# EAGLE design L3DCube_6x6x6_BaseBoard_Rev1.2 (EAGLE 7.6.0)
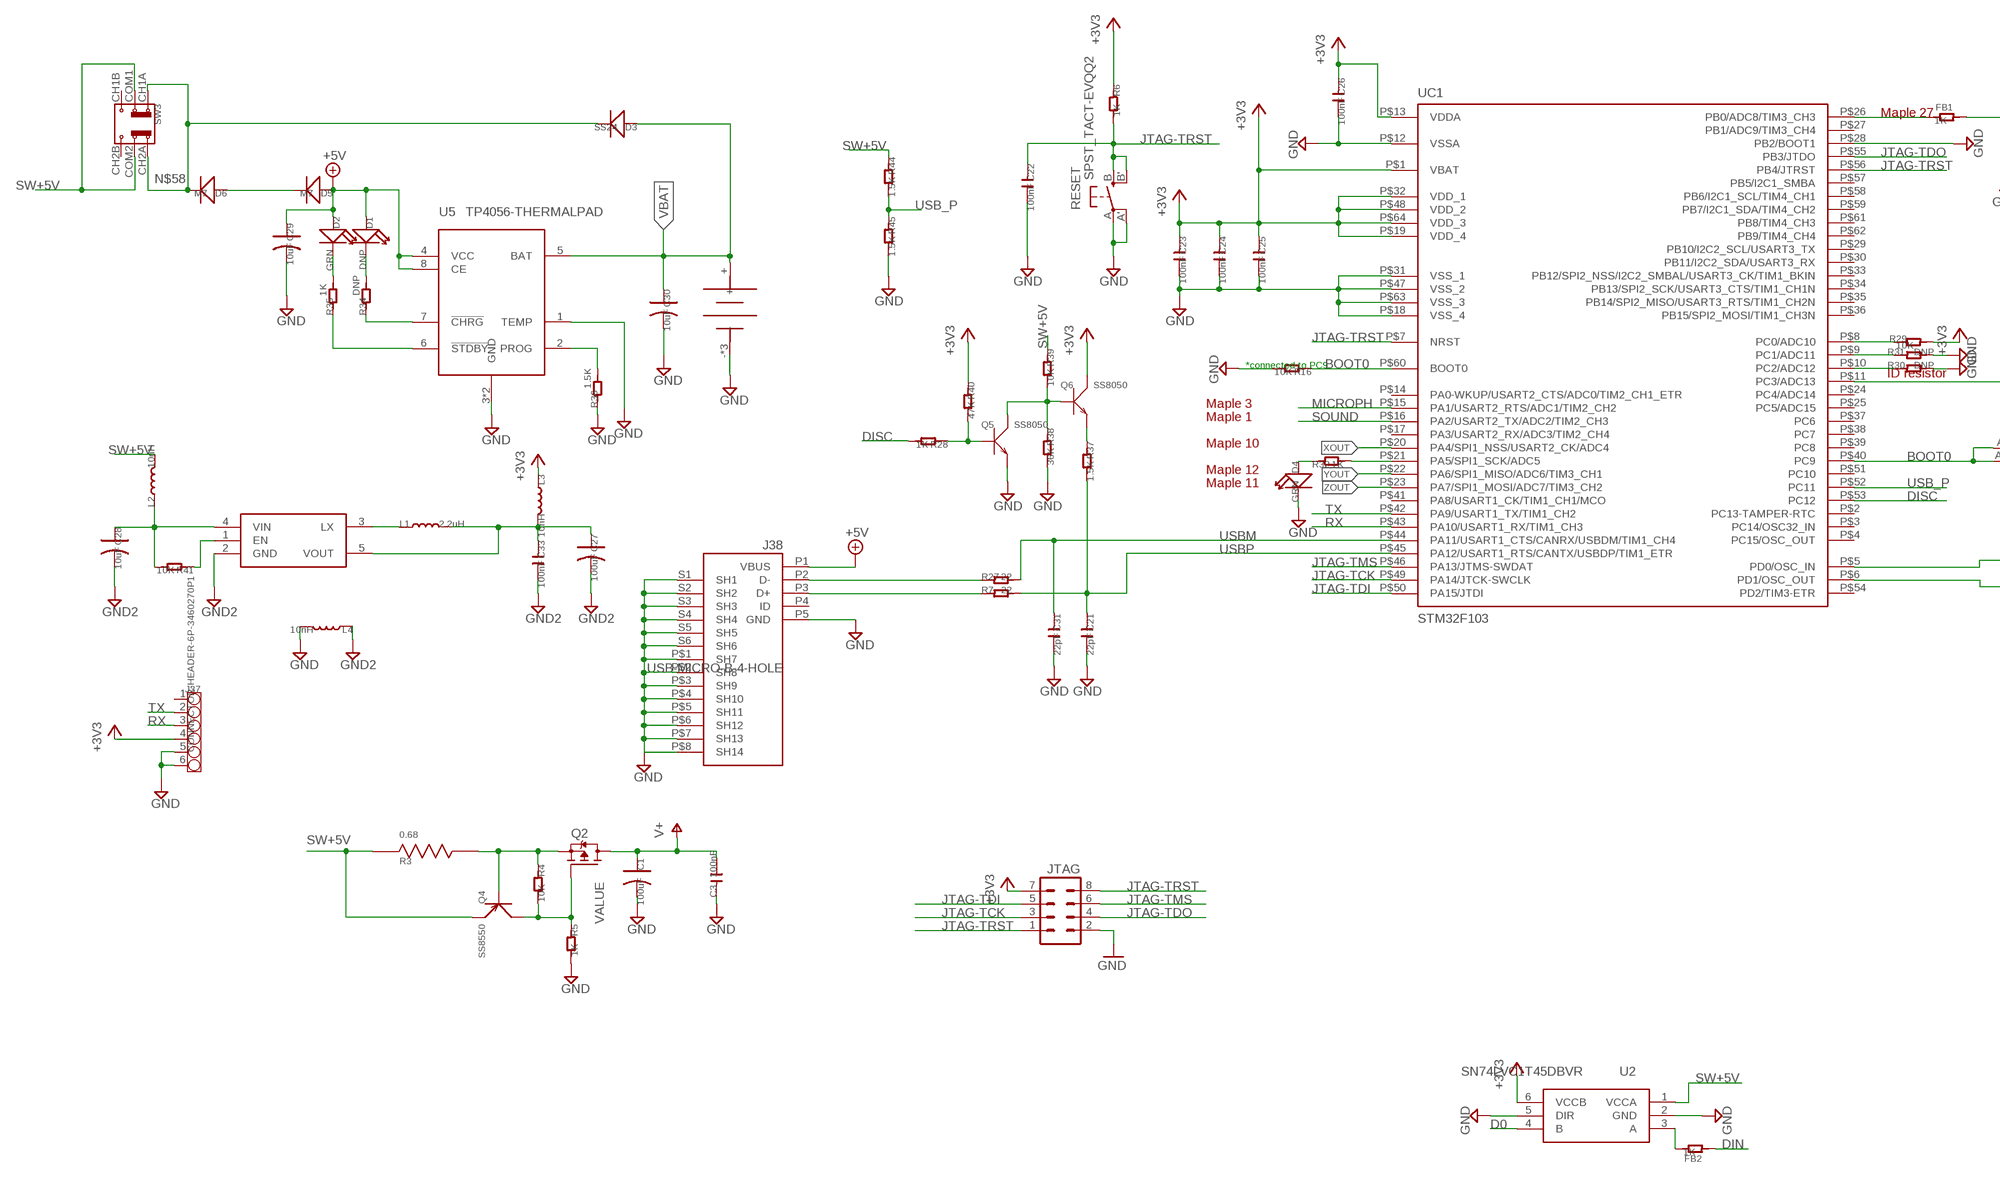
[diagram p0: schematic, sheet 1, part 1 of 2]
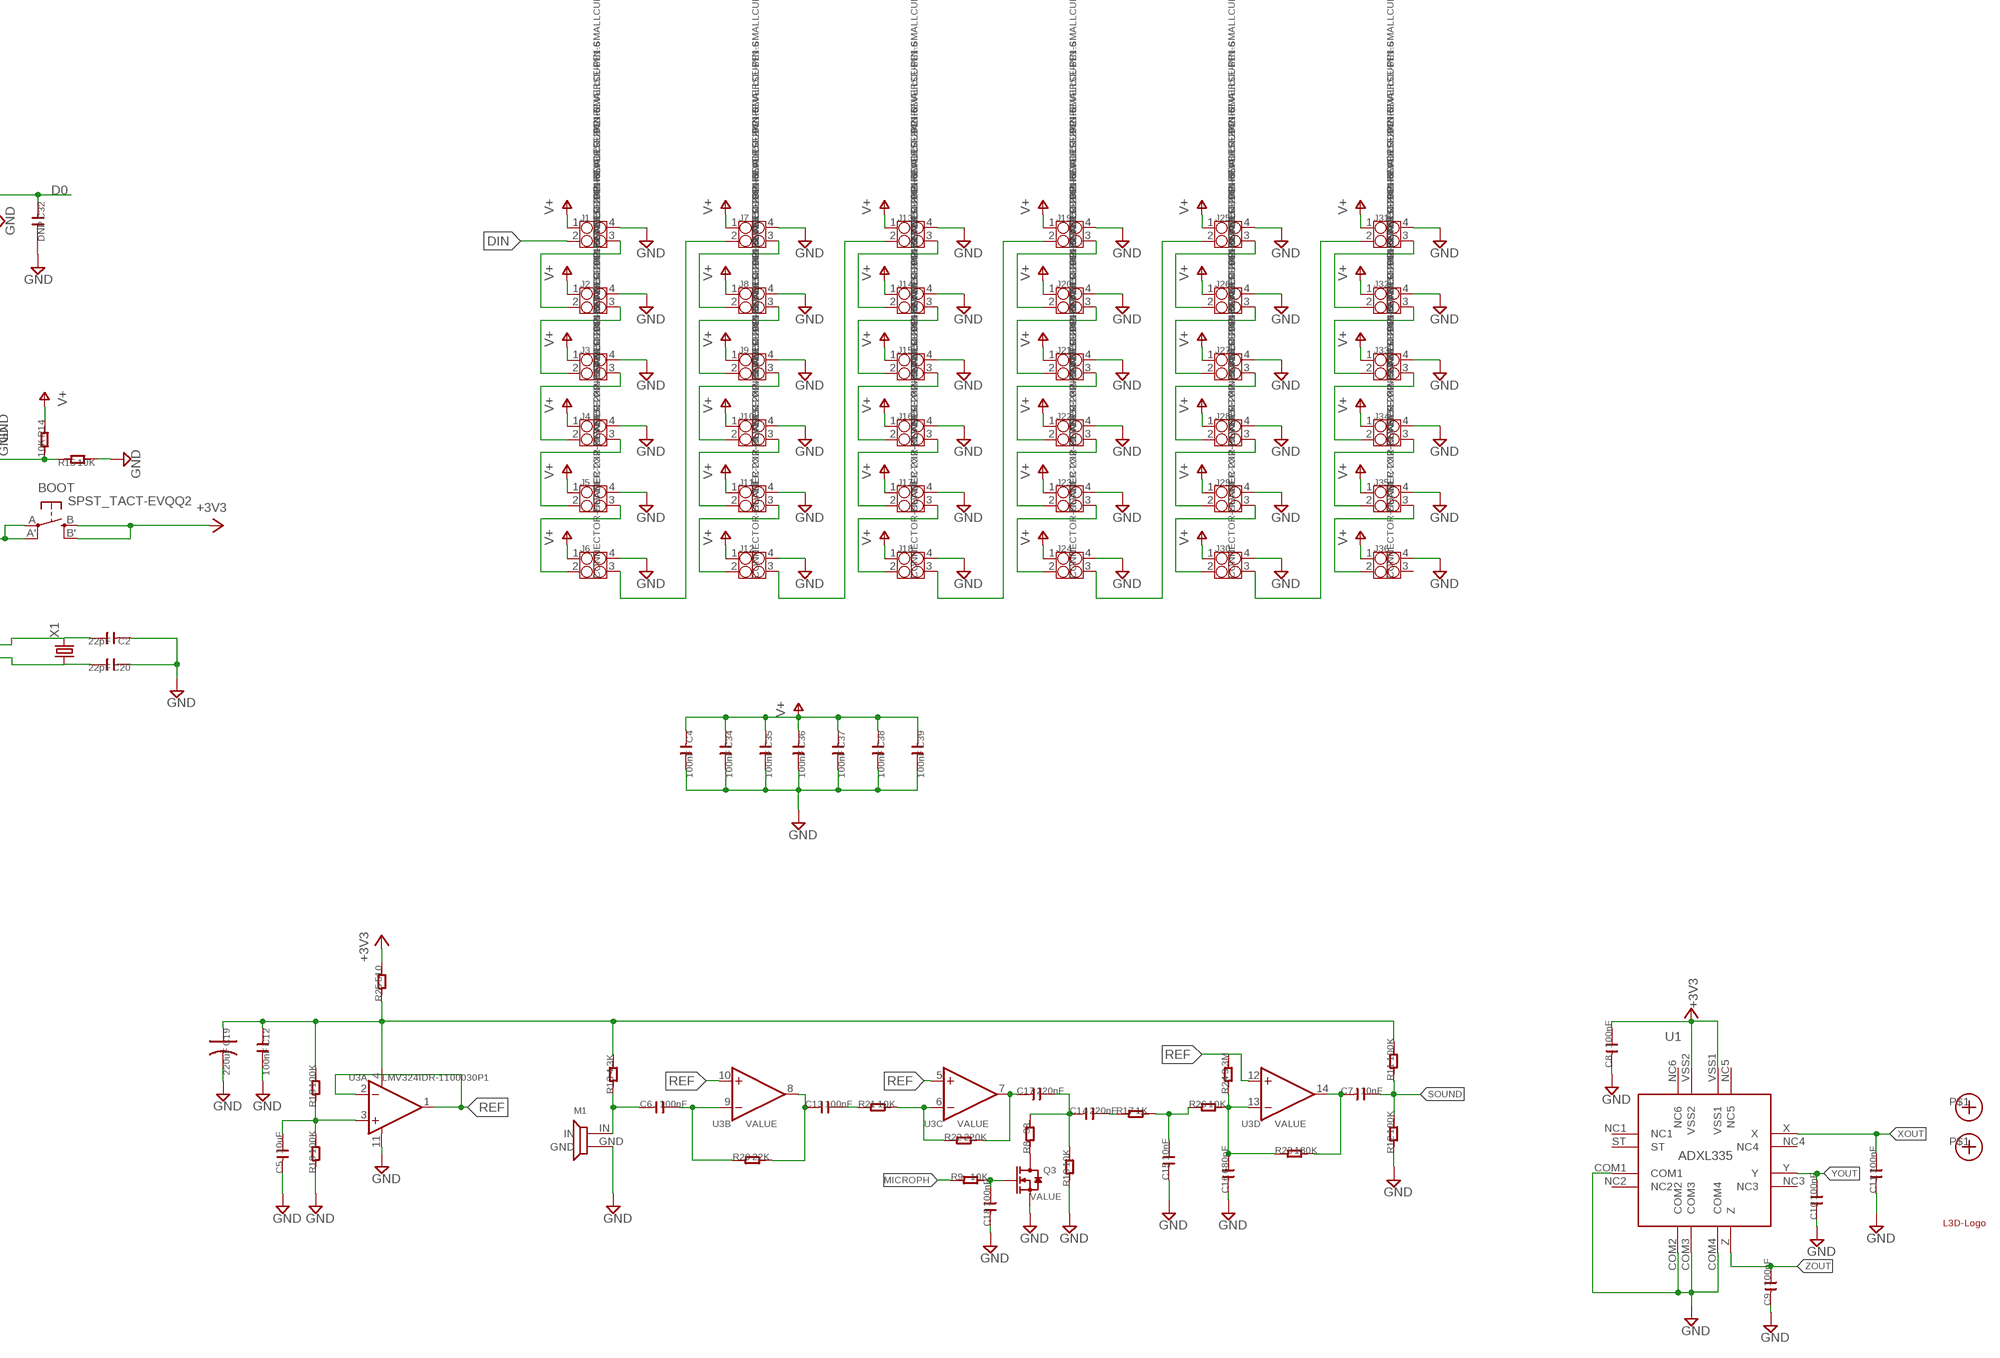
[diagram p1: schematic, sheet 1, part 2 of 2]

## Parts
B1  BATTERY  [2P-SMD-2.0-90D]
BOOT  SPST_TACT-EVQQ2  [EVQ-Q2]
C1  100uF  C-POLAR-B  [AVX-B]
C2  22pF  C-0603  [C0603]
C3  100nF  C-0603  [C0603]
C4  100nF  C-0603  [C0603]
C5  10uF  C-0603  [C0603]
C6  100nF  C-0603  [C0603]
C7  10nF  C-0603  [C0603]
C8  100nF  C-0603  [C0603]
C9  100nF  C-0603  [C0603]
C10  100nF  C-0603  [C0603]
C11  100nF  C-0603  [C0603]
C12  100nF  C-0603  [C0603]
C13  100nF  C-0603  [C0603]
C14  220nF  C-0603  [C0603]
C15  10nF  C-0603  [C0603]
C16  680pF  C-0603  [C0603]
C17  220nF  C-0603  [C0603]
C18  100nF  C-0603  [C0603]
C19  220uF  C-POLAR-B  [AVX-B]
C20  22pF  C-0603  [C0603]
C21  22pF  C-0603  [C0603]
C22  100nF  C-0603  [C0603]
C23  100nF  C-0603  [C0603]
C24  100nF  C-0603  [C0603]
C25  100nF  C-0603  [C0603]
C26  100nF  C-0603  [C0603]
C27  100uF  C-POLAR-B  [AVX-B]
C28  10uF  C-POLAR-A  [AVX-A]
C29  10uF  C-POLAR-A  [AVX-A]
C30  10uF  C-POLAR-A  [AVX-A]
C31  22pF  C-0603  [C0603]
C32  DNP  C-0603  [C0603]
C33  100nF  C-0603  [C0603]
C34  100nF  C-0603  [C0603]
C35  100nF  C-0603  [C0603]
C36  100nF  C-0603  [C0603]
C37  100nF  C-0603  [C0603]
C38  100nF  C-0603  [C0603]
C39  100nF  C-0603  [C0603]
D1  DNP  LED  [LED0603]
D2  GRN  LED  [LED0603]
D3  SS24  D-SMB  [SMB]
D4  GRN  LED  [LED0603]
D5  M7  D-SMA  [DO-214AC]
D6  M7  D-SMA  [DO-214AC]
FB1  1K  R-0603  [R0603]
FB2  1K  R-0603  [R0603]
J1  CONNECTOR-HEADER-2X2-REVERSE-PIN-SMALLCUBE1.6  [2X2P-2.54-6X6X6-CUBE-TH]
J2  CONNECTOR-HEADER-2X2-REVERSE-PIN-SMALLCUBE1.6  [2X2P-2.54-6X6X6-CUBE-TH]
J3  CONNECTOR-HEADER-2X2-REVERSE-PIN-SMALLCUBE1.6  [2X2P-2.54-6X6X6-CUBE-TH]
J4  CONNECTOR-HEADER-2X2-REVERSE-PIN-SMALLCUBE1.6  [2X2P-2.54-6X6X6-CUBE-TH]
J5  CONNECTOR-HEADER-2X2-REVERSE-PIN-SMALLCUBE1.6  [2X2P-2.54-6X6X6-CUBE-TH]
J6  CONNECTOR-HEADER-2X2-REVERSE-PIN-SMALLCUBE1.6  [2X2P-2.54-6X6X6-CUBE-TH]
J7  CONNECTOR-HEADER-2X2-REVERSE-PIN-SMALLCUBE1.6  [2X2P-2.54-6X6X6-CUBE-TH]
J8  CONNECTOR-HEADER-2X2-REVERSE-PIN-SMALLCUBE1.6  [2X2P-2.54-6X6X6-CUBE-TH]
J9  CONNECTOR-HEADER-2X2-REVERSE-PIN-SMALLCUBE1.6  [2X2P-2.54-6X6X6-CUBE-TH]
J10  CONNECTOR-HEADER-2X2-REVERSE-PIN-SMALLCUBE1.6  [2X2P-2.54-6X6X6-CUBE-TH]
J11  CONNECTOR-HEADER-2X2-REVERSE-PIN-SMALLCUBE1.6  [2X2P-2.54-6X6X6-CUBE-TH]
J12  CONNECTOR-HEADER-2X2-REVERSE-PIN-SMALLCUBE1.6  [2X2P-2.54-6X6X6-CUBE-TH]
J13  CONNECTOR-HEADER-2X2-REVERSE-PIN-SMALLCUBE1.6  [2X2P-2.54-6X6X6-CUBE-TH]
J14  CONNECTOR-HEADER-2X2-REVERSE-PIN-SMALLCUBE1.6  [2X2P-2.54-6X6X6-CUBE-TH]
J15  CONNECTOR-HEADER-2X2-REVERSE-PIN-SMALLCUBE1.6  [2X2P-2.54-6X6X6-CUBE-TH]
J16  CONNECTOR-HEADER-2X2-REVERSE-PIN-SMALLCUBE1.6  [2X2P-2.54-6X6X6-CUBE-TH]
J17  CONNECTOR-HEADER-2X2-REVERSE-PIN-SMALLCUBE1.6  [2X2P-2.54-6X6X6-CUBE-TH]
J18  CONNECTOR-HEADER-2X2-REVERSE-PIN-SMALLCUBE1.6  [2X2P-2.54-6X6X6-CUBE-TH]
J19  CONNECTOR-HEADER-2X2-REVERSE-PIN-SMALLCUBE1.6  [2X2P-2.54-6X6X6-CUBE-TH]
J20  CONNECTOR-HEADER-2X2-REVERSE-PIN-SMALLCUBE1.6  [2X2P-2.54-6X6X6-CUBE-TH]
J21  CONNECTOR-HEADER-2X2-REVERSE-PIN-SMALLCUBE1.6  [2X2P-2.54-6X6X6-CUBE-TH]
J22  CONNECTOR-HEADER-2X2-REVERSE-PIN-SMALLCUBE1.6  [2X2P-2.54-6X6X6-CUBE-TH]
J23  CONNECTOR-HEADER-2X2-REVERSE-PIN-SMALLCUBE1.6  [2X2P-2.54-6X6X6-CUBE-TH]
J24  CONNECTOR-HEADER-2X2-REVERSE-PIN-SMALLCUBE1.6  [2X2P-2.54-6X6X6-CUBE-TH]
J25  CONNECTOR-HEADER-2X2-REVERSE-PIN-SMALLCUBE1.6  [2X2P-2.54-6X6X6-CUBE-TH]
J26  CONNECTOR-HEADER-2X2-REVERSE-PIN-SMALLCUBE1.6  [2X2P-2.54-6X6X6-CUBE-TH]
J27  CONNECTOR-HEADER-2X2-REVERSE-PIN-SMALLCUBE1.6  [2X2P-2.54-6X6X6-CUBE-TH]
J28  CONNECTOR-HEADER-2X2-REVERSE-PIN-SMALLCUBE1.6  [2X2P-2.54-6X6X6-CUBE-TH]
J29  CONNECTOR-HEADER-2X2-REVERSE-PIN-SMALLCUBE1.6  [2X2P-2.54-6X6X6-CUBE-TH]
J30  CONNECTOR-HEADER-2X2-REVERSE-PIN-SMALLCUBE1.6  [2X2P-2.54-6X6X6-CUBE-TH]
J31  CONNECTOR-HEADER-2X2-REVERSE-PIN-SMALLCUBE1.6  [2X2P-2.54-6X6X6-CUBE-TH]
J32  CONNECTOR-HEADER-2X2-REVERSE-PIN-SMALLCUBE1.6  [2X2P-2.54-6X6X6-CUBE-TH]
J33  CONNECTOR-HEADER-2X2-REVERSE-PIN-SMALLCUBE1.6  [2X2P-2.54-6X6X6-CUBE-TH]
J34  CONNECTOR-HEADER-2X2-REVERSE-PIN-SMALLCUBE1.6  [2X2P-2.54-6X6X6-CUBE-TH]
J35  CONNECTOR-HEADER-2X2-REVERSE-PIN-SMALLCUBE1.6  [2X2P-2.54-6X6X6-CUBE-TH]
J36  CONNECTOR-HEADER-2X2-REVERSE-PIN-SMALLCUBE1.6  [2X2P-2.54-6X6X6-CUBE-TH]
J37  CONNECTOR-HEADER-6P-3460270P1  [1X6P-2.54-8.5-BLACK-FEMALE]
J38  USB-MICRO-B-4-HOLE  [CON2_USB_MICRO_B_AT]
JTAG  MA04-2  [MA04-2]
L1  2.2uH  L-SPD3D16-4R7M  [L0420]
L2  10nH  L-0603  [L0603]
L3  10nH  L-0603  [L0603]
L4  10nH  L-0603  [L0603]
M1  MICROPHONE  [MICROPHONE]
Q2  FDD6637  FDD4141TO252  [TO252]
Q3  2N7002  MOSFET-N-044020001  [SOT23]
Q4  SS8550  TRANSISTOR-PNP-041003001  [SOT23]
Q5  SS8050  TRANSISTOR-NPN-0400000P1  [SOT23]
Q6  SS8050  TRANSISTOR-NPN-0400000P1  [SOT23]
R3  0.68  RESISTOR-3W-20MM  [RESISTOR-3W-20MM]
R4  10K  R-0603  [R0603]
R5  1K  R-0603  [R0603]
R6  1K  R-0603  [R0603]
R7  22  R-0603  [R0603]
R8  33  R-0603  [R0603]
R9  10K  R-0603  [R0603]
R10  10K  R-0603  [R0603]
R11  100K  R-0603  [R0603]
R12  100K  R-0603  [R0603]
R13  4.3K  R-0603  [R0603]
R14  10K  R-0603  [R0603]
R15  10K  R-0603  [R0603]
R16  10K  R-0603  [R0603]
R17  1K  R-0603  [R0603]
R18  100K  R-0603  [R0603]
R19  100K  R-0603  [R0603]
R20  22K  R-0603  [R0603]
R21  10K  R-0603  [R0603]
R22  220K  R-0603  [R0603]
R23  180K  R-0603  [R0603]
R24  3.3M  R-0603  [R0603]
R25  510  R-0603  [R0603]
R26  10K  R-0603  [R0603]
R27  22  R-0603  [R0603]
R28  1K  R-0603  [R0603]
R29  10K  R-0603  [R0603]
R30  DNP  R-0603  [R0603]
R31  DNP  R-0603  [R0603]
R32  1K  R-0603  [R0603]
R34  DNP  R-0603  [R0603]
R35  1K  R-0603  [R0603]
R36  1.5K  R-0603  [R0603]
R37  1.5K  R-0603  [R0603]
R38  36K  R-0603  [R0603]
R39  10K  R-0603  [R0603]
R40  47K  R-0603  [R0603]
R41  10K  R-0402  [R0402]
R44  1.5K  R-0603  [R0603]
R45  1.5K  R-0603  [R0603]
RESET  SPST_TACT-EVQQ2  [EVQ-Q2]
SW3  SWITCH-22D02  [SWITCH-22D02]
U1  ADXL335  [ADXL335]
U2  SN74LVC1T45DBVR  [SOT23-6]
U3  LMV324IDR-1100030P1  [SOIC14]
U5  TP4056-THERMALPAD  [SOIC8-PAD]
U11  R8008-33  [SOT23-5]
U$1  L3D-LOGOL3DCUBE-LOGO-0.8X2.5  [L3DCUBE-LOGO-0.8X2.5]
U$2  FIDUCIAL-MARK  [FIDUCIAL-MARK]
U$3  FIDUCIAL-MARK  [FIDUCIAL-MARK]
UC1  STM32F103  [TQFP-10X10-64]
X1  CRYSTALSM49  [SM49]

## Nets
+3V3: BOOT.B'(S1) BOOT.B(S) C8.2 C23.1 C24.1 C25.1 C26.1 J37.4 JTAG.7 L3.1 Q6.3(C) R6.1 R25.2 R29.1 R40.1 U1.VSS1 U1.VSS2 U2.6(VCCB) UC1.P$1(VBAT) UC1.P$13(VDDA) UC1.P$19(VDD_4) UC1.P$32(VDD_1) UC1.P$48(VDD_2) UC1.P$64(VDD_3)
+5V: C29.+ D1.+ D2.+ D5.1(+) J38.P1(VBUS) U5.4(VCC) U5.8(CE)
BOOT0: BOOT.A'(P1) BOOT.A(P) R16.1 UC1.P$40(PC9) UC1.P$60(BOOT0)
D0: C32.1 FB1.1 U2.4(B)
DIN: FB2.1 J1.2
DISC: R28.2 UC1.P$53(PC12)
ENABLE [vcc]: R41.1 U11.1(EN)
GND [vcc]: B1.3(-) B1.4(-) B1.- C1.- C2.1 C3.1 C4.2 C5.1 C8.1 C9.1 C10.1 C11.1 C12.2 C15.1 C16.1 C18.1 C19.- C20.1 C21.2 C22.2 C23.2 C24.2 C25.2 C26.2 C29.- C30.- C31.2 C32.2 C34.2 C35.2 C36.2 C37.2 C38.2 C39.2 D4.- J1.4 J2.4 J3.4 J4.4 J5.4 J6.4 J7.4 J8.4 J9.4 J10.4 J11.4 J12.4 J13.4 J14.4 J15.4 J16.4 J17.4 J18.4 J19.4 J20.4 J21.4 J22.4 J23.4 J24.4 J25.4 J26.4 J27.4 J28.4 J29.4 J30.4 J31.4 J32.4 J33.4 J34.4 J35.4 J36.4 J37.5 J37.6 J38.P5(GND) J38.P$1(SH7) J38.P$2(SH8) J38.P$3(SH9) J38.P$4(SH10) J38.P$5(SH11) J38.P$6(SH12) J38.P$7(SH13) J38.P$8(SH14) J38.S1(SH1) J38.S2(SH2) J38.S3(SH3) J38.S4(SH4) J38.S5(SH5) J38.S6(SH6) JTAG.2 L4.2 M1.GND Q3.2(S) Q5.2(E) R5.2 R10.1 R12.1 R15.2 R16.2 R19.1 R30.2 R31.2 R36.1 R38.2 R45.2 RESET.A'(P1) RESET.A(P) U1.COM1 U1.COM2 U1.COM3 U1.COM4 U2.2(GND) U2.5(DIR) U3.11(A:V-) U5.1(TEMP) U5.3(GND) U5.GND1(GND) UC1.P$12(VSSA) UC1.P$18(VSS_4) UC1.P$28(PB2/BOOT1) UC1.P$31(VSS_1) UC1.P$47(VSS_2) UC1.P$63(VSS_3)
GND2: C27.- C28.- C33.2 L4.1 U11.2(GND)
JTAG-TCK: JTAG.3 UC1.P$49(PA14/JTCK-SWCLK)
JTAG-TDI: JTAG.5 UC1.P$50(PA15/JTDI)
JTAG-TDO: JTAG.4 UC1.P$55(PB3/JTDO)
JTAG-TMS: JTAG.6 UC1.P$46(PA13/JTMS-SWDAT)
JTAG-TRST: C22.1 JTAG.1 JTAG.8 R6.2 RESET.B'(S1) RESET.B(S) UC1.P$7(NRST) UC1.P$56(PB4/JTRST)
LED1: D4.+ R32.1
MICROPH: R9.1 UC1.P$15(PA1/USART2_RTS/ADC1/TIM2_CH2)
N$1: J1.3 J2.2
N$2: J2.3 J3.2
N$3: J3.3 J4.2
N$4: J4.3 J5.2
N$5: J5.3 J6.2
N$6: J7.3 J8.2
N$7: J8.3 J9.2
N$8: J9.3 J10.2
N$9: J10.3 J11.2
N$10: J11.3 J12.2
N$11: J13.3 J14.2
N$12: J14.3 J15.2
N$13: J15.3 J16.2
N$14: J16.3 J17.2
N$15: J17.3 J18.2
N$16: J19.3 J20.2
N$17: J20.3 J21.2
N$18: J21.3 J22.2
N$19: J22.3 J23.2
N$20: J23.3 J24.2
N$21: J25.3 J26.2
N$22: J26.3 J27.2
N$23: J27.3 J28.2
N$24: J28.3 J29.2
N$25: J29.3 J30.2
N$26: J31.3 J32.2
N$27: J32.3 J33.2
N$28: J33.3 J34.2
N$29: J34.3 J35.2
N$30: J35.3 J36.2
N$31: J6.3 J7.2
N$32: C18.2 Q3.1(G) R9.2
N$33: J12.3 J13.2
N$34: J18.3 J19.2
N$35: J24.3 J25.2
N$36: J30.3 J31.2
N$37: C2.2 UC1.P$5(PD0/OSC_IN) X1.2
N$38: C20.2 UC1.P$6(PD1/OSC_OUT) X1.1
N$39: R14.2 R15.1 UC1.P$11(PC3/ADC13)
N$40: J38.P2(D-) R27.1
N$41: L1.1 U11.3(LX)
N$42: D1.- R34.2
N$43: R32.2 UC1.P$21(PA5/SPI1_SCK/ADC5)
N$44: FB1.2 UC1.P$26(PB0/ADC8/TIM3_CH3)
N$45: R29.2 UC1.P$8(PC0/ADC10)
N$46: D2.- R35.2
N$47: R34.1 U5.7(!CHRG)
N$48: R35.1 U5.6(!STDBY)
N$49: R36.2 U5.2(PROG)
N$50: R30.1 UC1.P$10(PC2/ADC12)
N$51: Q6.2(E) R37.1
N$52: C28.+ L2.1 R41.2 U11.4(VIN)
N$53: R31.1 UC1.P$9(PC1/ADC11)
N$55: J38.P3(D+) R7.1
N$56: C27.+ C33.1 L1.2 L3.2 U11.5(VOUT)
N$57: FB2.2 U2.3(A)
N$58: D3.- D6.2(-) SW3.CH1A SW3.CH2A
N$59: D5.2(-) D6.1(+)
N$65: Q2.2(S) Q4.1(B) R3.2 R4.1
N$66: Q3.3(D) R8.1
N$67: Q2.1(G) Q4.3(C) R4.2 R5.1
N$68: C14.2 R17.1
N$69: C15.2 R17.2 R26.1
N$70: C16.2 R23.1 R24.1 R26.2 U3.13(D:IN-)
N$71: Q5.3(C) Q6.1(B) R38.1 R39.2
N$72: C6.1 M1.IN R13.1
N$73: Q5.1(B) R28.1 R40.2
N$96: C5.2 R18.1 R19.2 U3.3(A:IN+)
N$97: C6.2 R20.1 U3.9(B:IN-)
N$98: C13.1 R20.2 U3.8(B:OUT)
N$99: C13.2 R21.1
N$100: R21.2 R22.1 U3.6(C:IN-)
N$101: C14.1 C17.2 R8.2 R10.2
N$102: C12.1 C19.+ R11.2 R13.2 R18.2 R25.1 U3.4(A:V+)
N$104: C7.1 R23.2 U3.14(D:OUT)
N$106: C17.1 R22.2 U3.7(C:OUT)
REF: R24.2 U3.1(A:OUT) U3.2(A:IN-) U3.5(C:IN+) U3.10(B:IN+) U3.12(D:IN+)
RX: J37.3 UC1.P$43(PA10/USART1_RX/TIM1_CH3)
SOUND: C7.2 R11.1 R12.2 UC1.P$16(PA2/USART2_TX/ADC2/TIM2_CH3)
SW+5V: L2.2 Q4.2(E) R3.1 R39.1 R44.1 SW3.COM1 SW3.COM2 U2.1(VCCA)
TX: J37.2 UC1.P$42(PA9/USART1_TX/TIM1_CH2)
USB_P: R44.2 R45.1 UC1.P$52(PC11)
USBM: C31.1 R27.2 UC1.P$44(PA11/USART1_CTS/CANRX/USBDM/TIM1_CH4)
USBP: C21.1 R7.2 R37.2 UC1.P$45(PA12/USART1_RTS/CANTX/USBDP/TIM1_ETR)
V+: C1.+ C3.2 C4.1 C34.1 C35.1 C36.1 C37.1 C38.1 C39.1 J1.1 J2.1 J3.1 J4.1 J5.1 J6.1 J7.1 J8.1 J9.1 J10.1 J11.1 J12.1 J13.1 J14.1 J15.1 J16.1 J17.1 J18.1 J19.1 J20.1 J21.1 J22.1 J23.1 J24.1 J25.1 J26.1 J27.1 J28.1 J29.1 J30.1 J31.1 J32.1 J33.1 J34.1 J35.1 J36.1 Q2.3(D) R14.1
VBAT: B1.+ C30.+ D3.+ U5.5(BAT)
XOUT: C11.2 U1.X UC1.P$20(PA4/SPI1_NSS/USART2_CK/ADC4)
YOUT: C10.2 U1.Y UC1.P$22(PA6/SPI1_MISO/ADC6/TIM3_CH1)
ZOUT: C9.2 U1.Z UC1.P$23(PA7/SPI1_MOSI/ADC7/TIM3_CH2)
Unconnected: J36.3 J37.1 J38.P4(ID) SW3.CH1B SW3.CH2B U1.NC1 U1.NC2 U1.NC3 U1.NC4 U1.NC5 U1.NC6 U1.ST U$2.P$1 U$3.P$1 UC1.P$2(PC13-TAMPER-RTC) UC1.P$3(PC14/OSC32_IN) UC1.P$4(PC15/OSC_OUT) UC1.P$14(PA0-WKUP/USART2_CTS/ADC0/TIM2_CH1_ETR) UC1.P$17(PA3/USART2_RX/ADC3/TIM2_CH4) UC1.P$24(PC4/ADC14) UC1.P$25(PC5/ADC15) UC1.P$27(PB1/ADC9/TIM3_CH4) UC1.P$29(PB10/I2C2_SCL/USART3_TX) UC1.P$30(PB11/I2C2_SDA/USART3_RX) UC1.P$33(PB12/SPI2_NSS/I2C2_SMBAL/USART3_CK/TIM1_BKIN) UC1.P$34(PB13/SPI2_SCK/USART3_CTS/TIM1_CH1N) UC1.P$35(PB14/SPI2_MISO/USART3_RTS/TIM1_CH2N) UC1.P$36(PB15/SPI2_MOSI/TIM1_CH3N) UC1.P$37(PC6) UC1.P$38(PC7) UC1.P$39(PC8) UC1.P$41(PA8/USART1_CK/TIM1_CH1/MCO) UC1.P$51(PC10) UC1.P$54(PD2/TIM3-ETR) UC1.P$57(PB5/I2C1_SMBA) UC1.P$58(PB6/I2C1_SCL/TIM4_CH1) UC1.P$59(PB7/I2C1_SDA/TIM4_CH2) UC1.P$61(PB8/TIM4_CH3) UC1.P$62(PB9/TIM4_CH4)

## Notes on the sheet
- Maple 27
- *connected to PC9 | ID resistor
- Maple 3
- Maple 1
- Maple 10
- Maple 12
- Maple 11

## Library data of the parts
B1 = OPL Eagle Library:BATTERY
BOOT RESET = adafruit:SPST_TACT: SMT 6mm switch, EVQQ2 series http://www.ladyada.net/library/eagle
C1 C19 C27-C30 = OPL Eagle Library:C-POLAR*
C2-C18 C20-C26 C31-C39 = OPL Eagle Library:C*
D1 D2 D4 = OPL Eagle Library:LED*: LED
D3 D5 D6 = OPL Eagle Library:D*: DIODE
FB1 FB2 R4-R32 R34-R41 R44 R45 = OPL Eagle Library:R*
J1-J36 = OPL Eagle Library:CONNECTOR-HEADER-2X2-REVERSE-PIN-SMALLCUBE
J37 = OPL Eagle Library:CONNECTOR-HEADER-6P
J38 = Arduino-DUE-V03:USB-MICRO-B-4-HOLE
JTAG = con-lstb:MA04-2: PIN HEADER
L1-L4 = OPL Eagle Library:L*
M1 = OPL Eagle Library:MICROPHONE
Q2 = transistor-fet:FDD4141: P-Channel PowerTrench® MOSFET Source: FDD4141.pdf
Q3 = OPL Eagle Library:MOSFET-N: CJ2302：SMD MOSFET N-CH 20V-2.1A
Q4 = OPL Eagle Library:TRANSISTOR-PNP*: S8550：PNP Transistor
Q5 Q6 = OPL Eagle Library:TRANSISTOR-NPN*: S9013：NPN Transistor
R3 = OPL Eagle Library:RESISTOR-3W-20MM
SW3 = OPL Eagle Library:SWITCH-22D02
U1 = OPL Eagle Library:ADXL335
U2 = OPL Eagle Library:SN74LVC1T45DBVR
U3 = OPL Eagle Library:LMV324IDR: General purpose LOW Voltage, Rail-to-Rail Output Amplifiers http://www.fairchildsemi.com/ds/LM/LMV358.pdf
U5 = OPL Eagle Library:TP4056
U11 = Spark:R8008-33
U$1 = OPL Eagle Library:L3D-LOGO
U$2 U$3 = OPL Eagle Library:FIDUCIAL-MARK
UC1 = st-microelectronics:STM32F103
X1 = adafruit:CRYSTAL: CRYSTAL; OC_FARNELL: unknown; OC_NEWARK: unknown

## Net classes
3 usbvcc: width 0.254 mm, drill 0.61 mm, clearance 0.254 mm

## Board
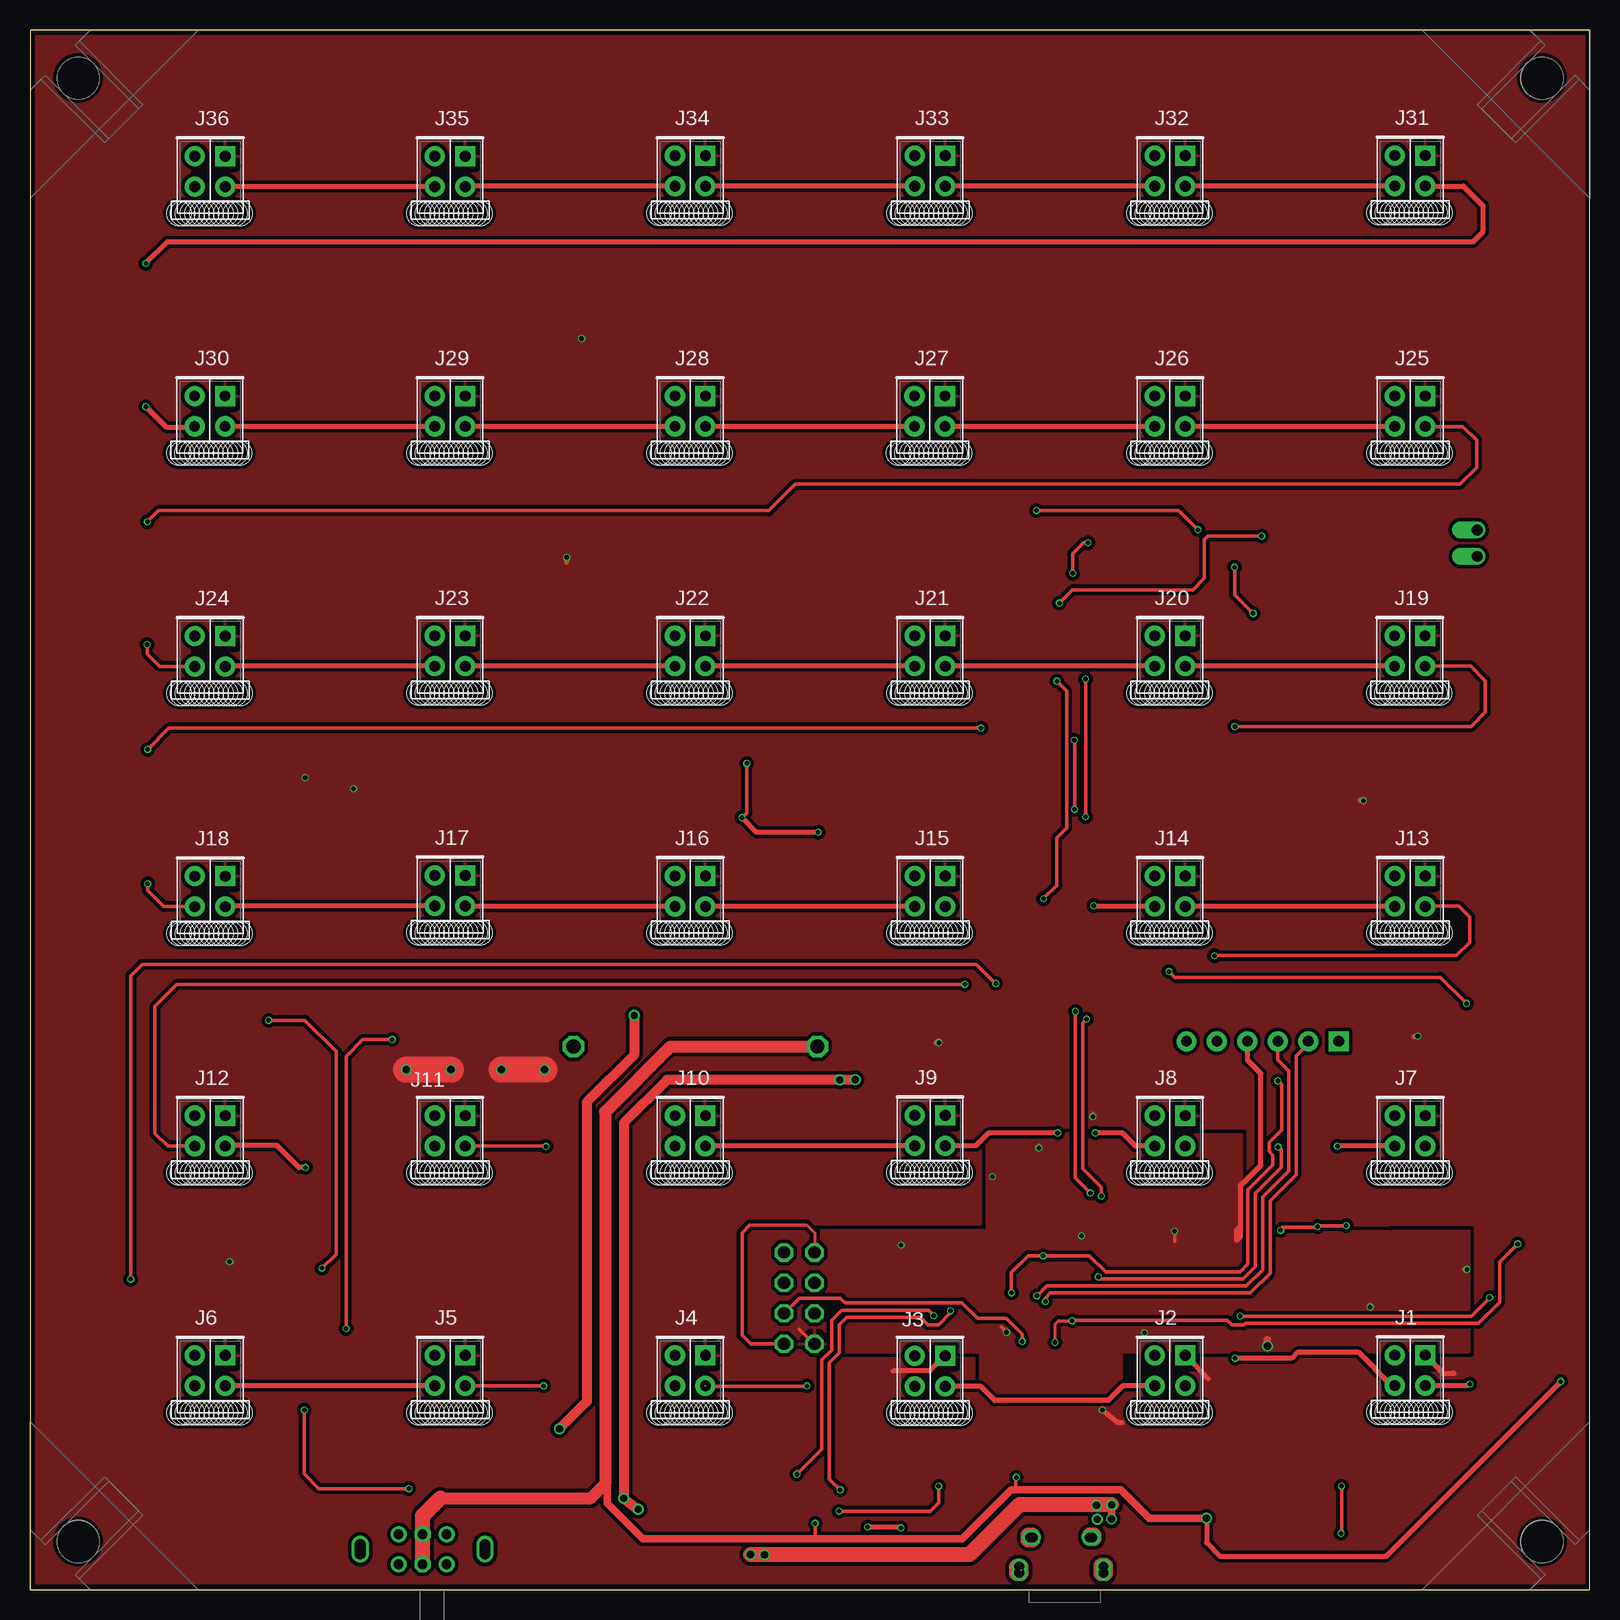
[diagram p2: board, top side]
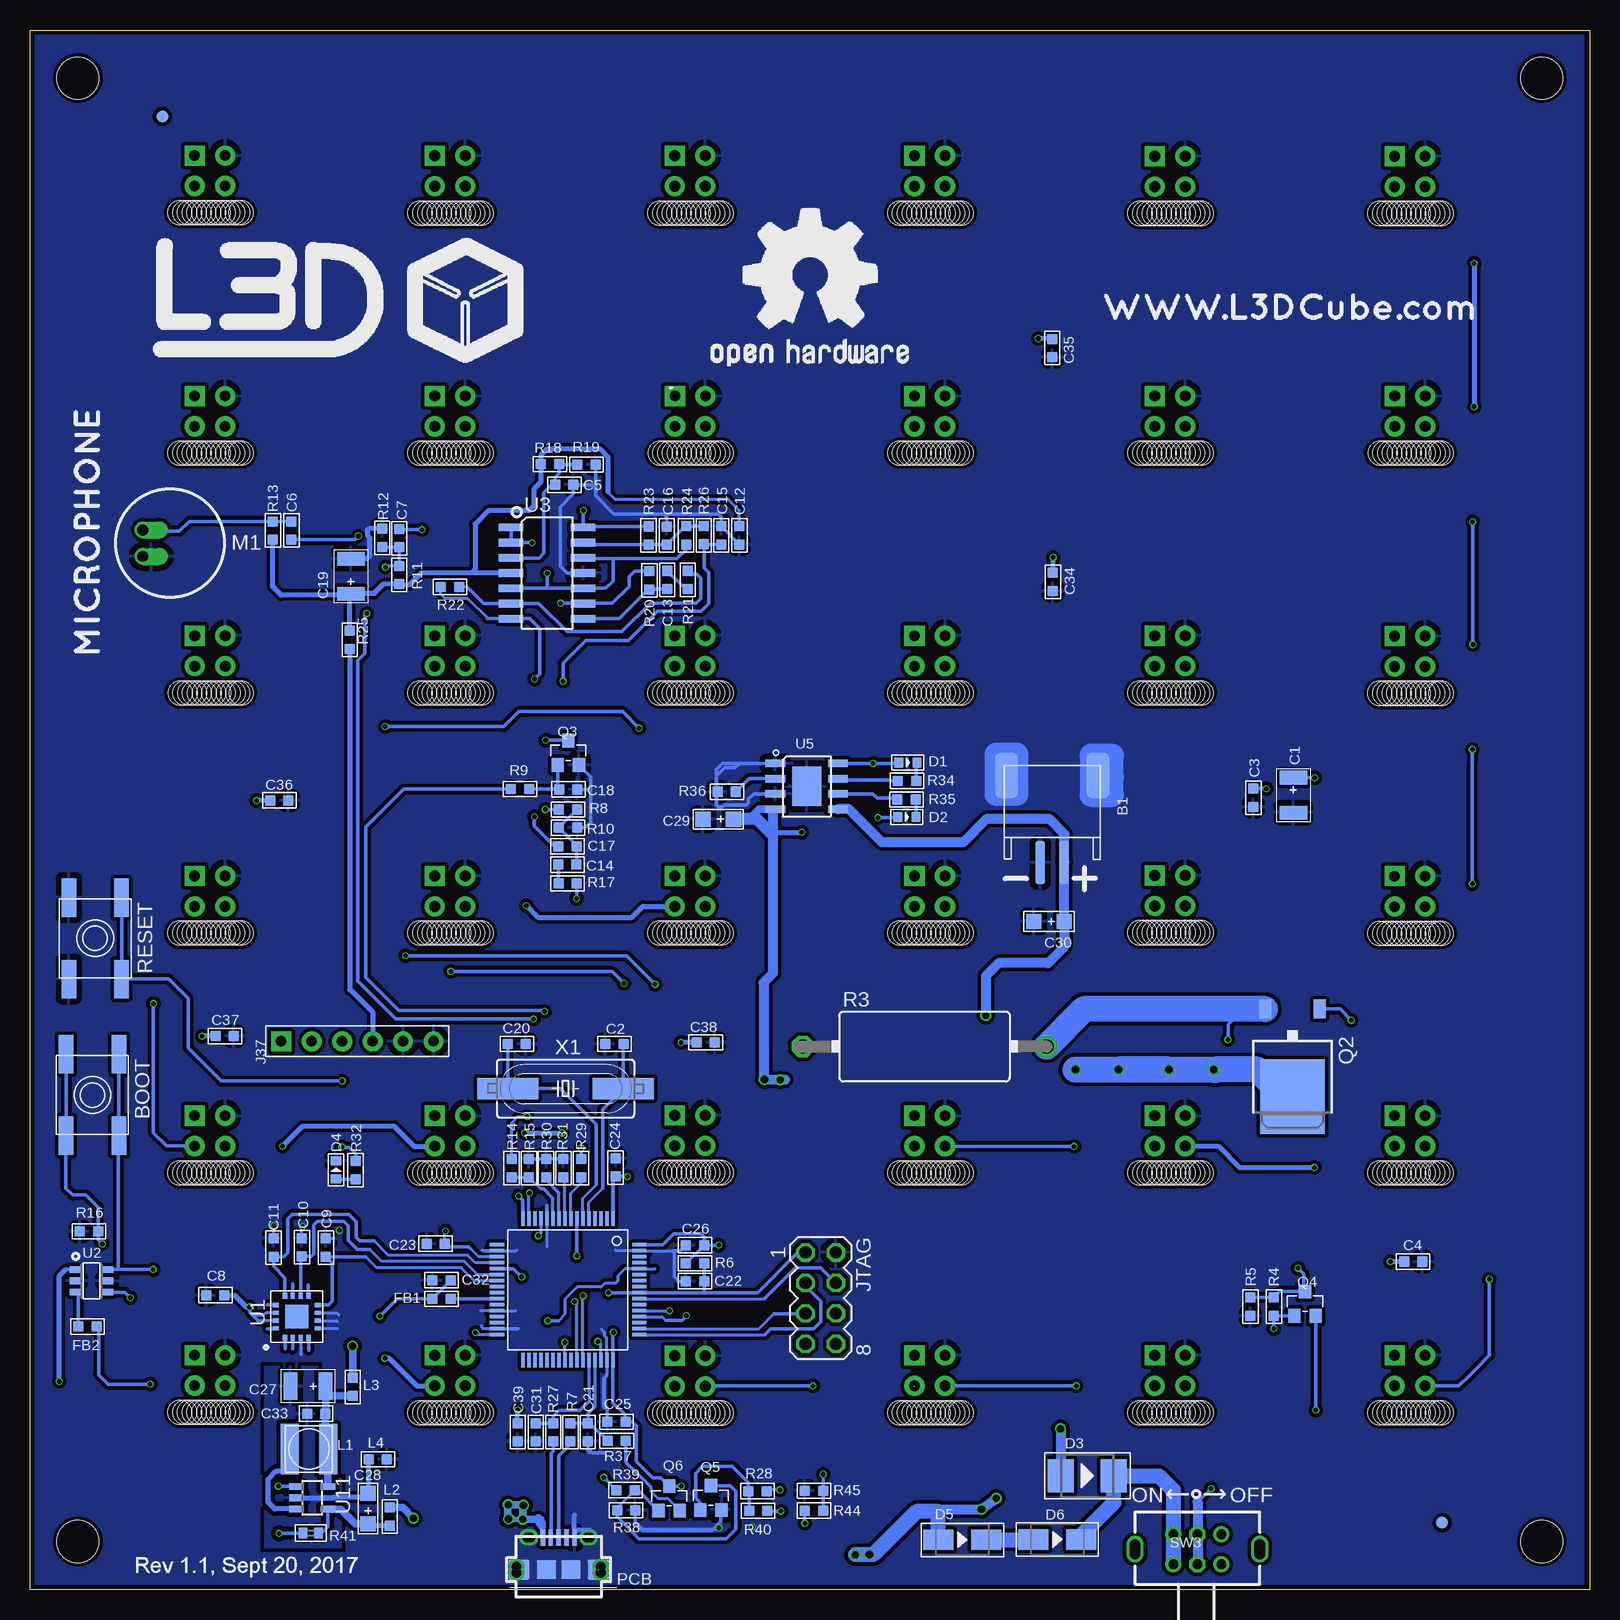
[diagram p3: board, bottom side, seen from below]

Size 130 x 130.02 mm. Coordinates in mm from the lower left corner, seen from the top.
Outline: 130,130.02 0,130.02 0,0 130,0 130,130.02
Copper layers (1*16): Top 0.035mm / dielectric 0.5mm / Bottom 0.035mm
Design rules "default *": minimum track width 10mil, minimum drill 15mil, track to track 8mil, track to pad 0mil, pad to pad 0mil, via to via 0mil, smd to smd 8mil, copper to edge 0mil, drill to drill 0mil, minimum pad ring 10mil, minimum via ring 0mil, stop-mask expansion 4mil, vias tented up to drill 0mil, thermal gap 20mil
Holes 3.51 mm at 4.01,4.01 126.01,4.01 4.01,126.01 126.01,126.01

### Footprints (pad centres in the part's own frame; a part is rotated, then mirrored left to right if it is on the bottom)
2P-SMD-2.0-90D = smd 1.93 x 3.81: 3 3.8,-2.181; 4 -3.8,-2.181 | smd 0.8 x 3.6: + -1,5.08; - 1,5.08
EVQ-Q2 = smd 3.2 x 1.2: A -3.4,-2.2; A' 3.4,-2.2; B -3.4,2.2; B' 3.4,2.2
AVX-B = smd 1.143 x 2.286: + -1.46,0; - 1.46,0
C0603 = smd 0.889 x 0.889: 1 -0.762,0; 2 0.762,0
AVX-A = smd 1.27 x 1.27: + -1.27,0; - 1.27,0
LED0603 = smd 0.762 x 0.889: + -0.762,0; - 0.762,0
SMB = smd 2.159 x 2.743: + -2.21,0; - 2.21,0
DO-214AC = smd 2.5 x 1.7: 1 -2,0; 2 2,0
R0603 = smd 0.889 x 0.889: 1 -0.762,0; 2 0.762,0
2X2P-2.54-6X6X6-CUBE-TH = drill 0.9 pad 1.676 square: 1 -1.27,-1.27 | drill 0.9 pad 1.676: 2 -1.27,1.27; 3 1.27,1.27; 4 1.27,-1.27 | hole 2: -2.1,3.5; -1.7,3.5; -1.3,3.5; -0.9,3.5; -0.5,3.5; -0.1,3.5; 0.3,3.5; 0.7,3.5; 1.1,3.5; 1.5,3.5; 1.9,3.5; 2.3,3.5; -2.5,3.5; 2.6,3.5
1X6P-2.54-8.5-BLACK-FEMALE = drill 0.889 pad 1.651 square: 1 0,6.35 | drill 0.889 pad 1.651: 2 0,3.81; 3 0,1.27; 4 0,-1.27; 5 0,-3.81; 6 0,-6.35
CON2_USB_MICRO_B_AT = smd 0.406 x 1.346: P1 -1.321,2.692; P2 -0.66,2.692; P3 0,2.692; P4 0.66,2.692; P5 1.321,2.692 | drill 0.8 pad 1.27: P$1 -2.616,2.692 | drill 0.8 pad 1.245: P$2 -2.362,2.692; P$7 2.362,2.692; P$8 2.616,2.692 | drill 0.8 pad 1.143: P$3 -3.505,-0.254; P$4 -3.505,0.254; P$5 3.505,0.254; P$6 3.505,-0.254 | smd 1.778 x 1.651: S1 -3.302,0; S2 3.302,0 | smd 1.524 x 1.27: S3 -2.489,2.692; S4 2.489,2.692 | smd 1.626 x 1.524: S5 -1.016,0; S6 1.016,0
MA04-2 = drill 1.016 octagon: 1 -3.81,-1.27; 2 -3.81,1.27; 3 -1.27,-1.27; 4 -1.27,1.27; 5 1.27,-1.27; 6 1.27,1.27; 7 3.81,-1.27; 8 3.81,1.27
L0420 = smd 1.5 x 4.2: 1 -1.6,0; 2 1.6,0
L0603 = smd 0.889 x 0.889: 1 -0.762,0; 2 0.762,0
MICROPHONE = drill 0.9 offset: GND 0,-1.1; IN 0,1.1
TO252 = smd 1 x 1.6: 1 -2.28,-4.8; 2 2.28,-4.8 | smd 5.4 x 6.2: 3 0,2.5
SOT23 = smd 1.016 x 1.143: 1 -0.889,-1.016; 2 0.889,-1.016; 3 0,1.016
RESISTOR-3W-20MM = drill 1.194 octagon: 1 -10.16,0; 2 10.16,0
R0402 = smd 0.7 x 0.9: 1 -0.65,0; 2 0.65,0
SWITCH-22D02 = drill 0.813 pad 1.27: CH1A -2,-1.25; CH1B 2,-1.25; CH2A -2,1.25; CH2B 2,1.25 | drill 0.813 pad 1.27 octagon: COM1 0,-1.25; COM2 0,1.25 | drill 0.9: P$1 -5.2,0; P$2 5.2,0; P$3 -5.2,-0.2; P$4 -5.2,-0.4; P$5 -5.2,0.2; P$6 -5.2,0.4; P$7 5.2,-0.2; P$8 5.2,-0.4; P$9 5.2,0.2; P$10 5.2,0.4
ADXL335 = smd 0.5 x 0.35: COM1 -1.75,-0.325; NC1 -1.75,0.975; NC2 -1.75,-0.975; NC3 1.75,-0.975; NC4 1.75,0.325; ST -1.75,0.325; X 1.75,0.975; Y 1.75,-0.325 | smd 0.35 x 0.5: COM2 -0.975,-1.75; COM3 -0.325,-1.75; COM4 0.325,-1.75; NC5 0.975,1.75; NC6 -0.975,1.75; VSS1 0.325,1.75; VSS2 -0.325,1.75; Z 0.975,-1.75 | smd 1.95 x 1.95: P$17 0,0
SOT23-6 = smd 0.55 x 1: 1 -0.95,-1.3; 2 0,-1.3; 3 0.95,-1.3; 4 0.95,1.3; 5 0,1.3; 6 -0.95,1.3
SOIC14 = smd 2.032 x 0.66: 1 -2.997,3.81; 2 -2.997,2.54; 3 -2.997,1.27; 4 -2.997,0; 5 -2.997,-1.27; 6 -2.997,-2.54; 7 -2.997,-3.81; 8 2.997,-3.81; 9 2.997,-2.54; 10 2.997,-1.27; 11 2.997,0; 12 2.997,1.27; 13 2.997,2.54; 14 2.997,3.81
SOIC8-PAD = smd 1.651 x 0.635: 1 -2.616,1.905; 2 -2.616,0.635; 3 -2.616,-0.635; 4 -2.616,-1.905; 5 2.616,-1.905; 6 2.616,-0.635; 7 2.616,0.635; 8 2.616,1.905 | smd 2.4 x 3.3: GND1 0,0
SOT23-5 = smd 0.55 x 1.2: 1 -0.95,-1.3; 2 0,-1.3; 3 0.95,-1.3; 4 0.95,1.3; 5 -0.95,1.3
FIDUCIAL-MARK = smd 1 x 1: P$1 0,0
TQFP-10X10-64 = smd 1.2 x 0.3: P$1 -5.936,3.75; P$2 -5.936,3.25; P$3 -5.936,2.75; P$4 -5.936,2.25; P$5 -5.936,1.75; P$6 -5.936,1.25; P$7 -5.936,0.75; P$8 -5.936,0.25; P$9 -5.936,-0.25; P$10 -5.936,-0.75; P$11 -5.936,-1.25; P$12 -5.936,-1.75; P$13 -5.936,-2.25; P$14 -5.936,-2.75; P$15 -5.936,-3.25; P$16 -5.936,-3.75; P$33 5.886,-3.75; P$34 5.886,-3.25; P$35 5.886,-2.75; P$36 5.886,-2.25; P$37 5.886,-1.75; P$38 5.886,-1.25; P$39 5.886,-0.75; P$40 5.886,-0.25; P$41 5.886,0.25; P$42 5.886,0.75; P$43 5.886,1.25; P$44 5.886,1.75; P$45 5.886,2.25; P$46 5.886,2.75; P$47 5.886,3.25; P$48 5.886,3.75 | smd 0.3 x 1.2: P$17 -3.75,-5.911; P$18 -3.25,-5.911; P$19 -2.75,-5.911; P$20 -2.25,-5.911; P$21 -1.75,-5.911; P$22 -1.25,-5.911; P$23 -0.75,-5.911; P$24 -0.25,-5.911; P$25 0.25,-5.911; P$26 0.75,-5.911; P$27 1.25,-5.911; P$28 1.75,-5.911; P$29 2.25,-5.911; P$30 2.75,-5.911; P$31 3.25,-5.911; P$32 3.75,-5.911; P$49 3.75,5.936; P$50 3.25,5.936; P$51 2.75,5.936; P$52 2.25,5.936; P$53 1.75,5.936; P$54 1.25,5.936; P$55 0.75,5.936; P$56 0.25,5.936; P$57 -0.25,5.936; P$58 -0.75,5.936; P$59 -1.25,5.936; P$60 -1.75,5.936; P$61 -2.25,5.936; P$62 -2.75,5.936; P$63 -3.25,5.936; P$64 -3.75,5.936
SM49 = smd 5.08 x 1.778: 1 -4.826,0; 2 4.826,0

### Placement (x,y rotation side)
B1  44.81,65.71 180 bottom
BOOT  124.79,41.25 270 bottom
C1  24.71,66.24 270 bottom
C2  81.28,45.49 0 bottom
C3  28.04,66.02 90 bottom
C4  14.73,27.36 0 bottom
C5  85.47,92.11 180 bottom
C6  108.21,88.3 270 bottom
C7  99.23,87.66 270 bottom
C8  114.55,24.56 0 bottom
C9  105.33,28.52 270 bottom
C10  107.34,28.55 270 bottom
C11  109.7,28.52 270 bottom
C12  70.88,87.91 270 bottom
C13  76.89,84.18 90 bottom
C14  85.22,60.45 180 bottom
C15  72.4,87.91 270 bottom
C16  76.94,87.88 270 bottom
C17  85.22,61.98 0 bottom
C18  85.14,66.73 180 bottom
C19  103.25,84.48 90 bottom
C20  89.43,45.49 180 bottom
C21  83.52,13.13 270 bottom
C22  74.57,25.73 180 bottom
C23  96.19,28.85 180 bottom
C24  81.2,35.2 90 bottom
C25  81.13,14 180 bottom
C26  74.57,28.73 180 bottom
C27  106.83,16.97 180 bottom
C28  101.83,6.78 90 bottom
C29  72.64,64.24 180 bottom
C30  45.09,55.7 180 bottom
C31  87.86,13.13 270 bottom
C32  95.71,25.81 180 bottom
C33  106.15,14.68 180 bottom
C34  44.75,84.02 270 bottom
C35  44.81,103.5 270 bottom
C36  109.22,65.81 0 bottom
C37  113.77,46.15 0 bottom
C38  73.69,45.62 0 bottom
C39  89.36,13.13 270 bottom
D1  56.85,68.96 0 bottom
D2  56.92,64.41 0 bottom
D3  41.88,9.5 0 bottom
D4  104.5,35 90 bottom
D5  52.3,4.17 0 bottom
D6  44.4,4.19 0 bottom
FB1  95.71,24.26 0 bottom
FB2  125.2,21.95 180 bottom
J1  115.01,18.29 180 top
J2  95,18.26 180 top
J3  75.01,18.24 180 top
J4  55.02,18.26 180 top
J5  35,18.26 180 top
J6  15.01,18.26 180 top
J7  115.01,38.25 180 top
J8  95,38.25 180 top
J9  75.01,38.28 180 top
J10  55.02,38.25 180 top
J11  35,38.25 180 top
J12  15.01,38.25 180 top
J13  115.01,58.24 180 top
J14  95,58.24 180 top
J15  75.01,58.24 180 top
J16  55.02,58.24 180 top
J17  35,58.27 180 top
J18  15.01,58.22 180 top
J19  114.99,78.26 180 top
J20  95,78.26 180 top
J21  75.01,78.26 180 top
J22  55.02,78.26 180 top
J23  35,78.26 180 top
J24  15.01,78.23 180 top
J25  115.01,98.25 180 top
J26  95,98.25 180 top
J27  74.98,98.25 180 top
J28  55.02,98.25 180 top
J29  35,98.25 180 top
J30  14.99,98.25 180 top
J31  115.01,118.29 180 top
J32  95,118.26 180 top
J33  75.01,118.26 180 top
J34  55.02,118.26 180 top
J35  35,118.24 180 top
J36  15.01,118.24 180 top
J37  102.72,45.72 90 bottom
J38  85.94,1.68 0 bottom
JTAG  64.11,24.31 270 bottom
L1  106.76,11.73 0 bottom
L2  100.03,6.1 90 bottom
L3  103.1,16.92 270 bottom
L4  101.02,10.87 0 bottom
M1  120.6,87.25 0 bottom
Q2  24.79,43.61 180 bottom
Q3  85.14,69.77 0 bottom
Q4  23.75,23.85 0 bottom
Q5  73.25,7.67 0 bottom
Q6  76.73,7.62 0 bottom
R3  55.45,45.29 0 bottom
R4  26.34,23.6 90 bottom
R5  28.3,23.6 270 bottom
R6  74.57,27.2 0 bottom
R7  84.96,13.13 90 bottom
R8  85.17,65.05 0 bottom
R9  89.16,66.76 0 bottom
R10  85.17,63.53 180 bottom
R11  99.22,84.59 270 bottom
R12  100.65,87.69 270 bottom
R13  109.75,88.3 270 bottom
R14  89.87,35.15 270 bottom
R15  88.42,35.15 90 bottom
R16  125.07,29.87 180 bottom
R17  85.19,58.88 0 bottom
R18  86.66,93.83 180 bottom
R19  83.63,93.8 180 bottom
R20  78.38,84.15 270 bottom
R21  75.18,84.18 90 bottom
R22  95,83.6 180 bottom
R23  78.45,87.89 90 bottom
R24  75.32,87.91 270 bottom
R25  103.35,79.2 270 bottom
R26  73.86,87.91 90 bottom
R27  86.39,13.13 90 bottom
R28  69.37,8.23 0 bottom
R29  84.07,35.15 270 bottom
R30  87,35.15 90 bottom
R31  85.55,35.15 90 bottom
R32  102.87,34.98 90 bottom
R34  56.92,67.44 0 bottom
R35  56.95,65.89 0 bottom
R36  71.93,66.52 0 bottom
R37  81.1,12.42 180 bottom
R38  80.31,6.63 0 bottom
R39  80.37,8.31 0 bottom
R40  69.32,6.58 180 bottom
R41  106.6,4.72 0 bottom
R44  64.67,6.6 0 bottom
R45  64.67,8.26 180 bottom
RESET  124.56,54.31 270 bottom
SW3  32.72,3.38 0 bottom
U1  107.77,22.76 90 bottom
U2  124.87,25.76 270 bottom
U3  86.91,84.75 0 bottom
U5  65.28,66.98 0 bottom
U11  106.48,7.67 270 bottom
U$1  106.43,108.53 0 bottom
U$2  12.32,5.59 0 bottom
U$3  118.97,122.83 0 bottom
UC1  85.17,25.02 270 bottom
X1  85.37,41.78 0 bottom

### Tracks (layer width: path | path; a pad name or v marks a point on that pad's centre or on a via)
+3V3  (via drill 0.38, 0.6)
  Top 0.254: v87.63,29.52 87.58,29.36 | v92.86,21.44 93.09,21.44
  Top 0.305: v75.72,8.64 75.72,7.26 75.01,6.55 v67.41,6.55 | JTAG.7 65.38,20.52 65.28,20.52 64.08,21.72 | v72.59,28.73 72.77,28.73 | v95.38,29.9 95.38,29.03 | v84.07,36.83 84.1,36.85 84.1,37.03 | v80.21,34.44 80.24,34.47 80.37,34.47 | v81.38,21.46 80.95,21.92 | v119.74,26.7 119.48,26.7
  Top 0.406: 100.76,30.18 100.56,29.97 100.56,29.13 100.84,29.41 100.84,33.66 102.56,35.38 102.56,43.03 101.47,44.12 101.47,45.7 J37.4
  Top 0.61: v103.12,20.32 103.12,20.83
  Bottom 0.254: UC1.P$13 87.42,29.73 v87.63,29.52 | 92.45,21.27 UC1.P$32 92.69,21.27 v92.86,21.44 | U1.VSS2 111.02,22.43 | U1.VSS1 110.37,23.08 110.54,22.91 110.57,22.94 111.48,22.94 | C23.1 95.43,29.84 v95.38,29.9 | UC1.P$19 92.59,27.77 93.29,28.47
  Bottom 0.305: C24.1 81.42,34.23 UC1.P$1 81.41,30.96 81.41,34.42 81.38,34.44 v80.21,34.44 | UC1.P$64 77.25,28.77 76.35,29.67 74.07,29.67 73.81,29.41 C26.1 | R6.1 C26.1 | v75.72,8.64 Q6.3 77.42,9.32 78.11,9.32 79.48,10.69 79.48,13.66 79.81,13.99 C25.1 80.39,14.02 80.39,14.58 81.42,15.61 UC1.P$48 81.42,21.43 v81.38,21.46 | v67.41,6.55 68.53,6.55 R40.1 | C26.1 v72.59,28.73 | R29.1 v84.07,36.83 | BOOT.B BOOT.B' 122.63,37.81 122.63,26.87 122.81,26.7 | 111.02,22.43 111.02,22.47 111.48,22.94 111.68,23.14 v111.68,23.57 | C23.1 95.17,28.6 93.42,28.6 93.29,28.47 | U2.6 123.56,26.7 122.81,26.7 | 122.81,26.7 v119.74,26.7
  Bottom 0.406: R25.2 103.35,50.04 103.33,50.04 101.45,48.16 J37.4 | C8.2 112.93,24.56 111.89,23.52 v111.68,23.57
  Bottom 0.61: L3.1 103.1,20.3 v103.12,20.32
  pour Top (isolate 0.305): 59.44,29.97 79.76,29.97 79.76,38.1 100.94,37.95 100.94,29.82 119.89,29.97 119.89,19.81 90.93,19.81 90.93,15.75 79.25,15.75 79.25,19.81 59.44,19.81
+5V  (via drill 0.38, 0.6)
  Top 0.254: v60.05,2.95 61.19,2.95 v61.21,2.92 | 82.47,7.26 82.65,7.09
  Top 0.305: v59.33,64.36 59.74,64.77 v59.74,68.89 | v50.7,6.71 50.7,6.68
  Top 0.406: v65.68,63.14 60.55,63.14 v59.33,64.36
  Top 0.61: v60.05,2.95 60.05,2.92 v61.21,2.92 61.24,2.92 61.29,2.87 | v90.14,7.09 90.14,5.92 v90.12,5.89
  Top 0.813: v68.78,42.52 53.09,42.52 49.48,38.91 v49.48,7.62 | 49.43,7.67 v49.48,7.62 | v49.48,7.62 50.7,6.68
  Top 1.27: v90.14,7.09 82.65,7.09 82.45,7.09 78.28,2.92 60.07,2.92 v60.05,2.95
  Bottom 0.305: D1.+ 57.68,68.89 v59.74,68.89 U5.8 | D2.+ 57.73,64.36 v59.33,64.36 | 60.02,2.95 61.24,2.95 v61.21,2.92 | 60.2,3.1 60.02,2.92 | v67.49,42.49 67.03,42.49 67,42.52 v68.78,42.52
  Bottom 0.406: 87.33,5.21 87.43,5.54 87.55,5.84 | U5.4 67.89,63.17 67.84,63.12 65.71,63.12 v65.68,63.14 | 90.14,5.87 v90.12,5.89 | 89.69,5.89 90.17,6.38 | 90.02,5.87 88.98,5.87 | J38.P1 87.26,5.44 87.49,5.67
  Bottom 0.61: 70.56,64.24 70.05,64.24 69.22,65.08 U5.4 68.1,64.87 | 88.88,7.09 v88.88,7.04 88.92,7.09 | v90.14,7.09 88.92,7.09 | 90.17,7.06 90.17,6.38 90.17,5.89 v90.12,5.89 | 88.92,7.09 v88.92,5.87 | 87.33,5.21 87.71,5.87 v88.92,5.87 | v88.92,5.87 88.98,5.87
  Bottom 0.813: 87.61,5.89 87.49,5.67 87.43,5.54 | 68.1,64.87 68.1,51.38 68.86,50.62 68.86,42.6 v68.78,42.52 | 70.56,64.24 C29.+ | 54.3,6.51 54.13,6.68 50.72,6.68 49.73,7.42 v49.48,7.62 | 67.08,42.52 v68.78,42.52 | v68.78,42.52 68.89,42.52
  Bottom 1.016: 68.3,63.12 69.42,64.24 70.56,64.24
  Bottom 1.27: v61.21,2.92 60.02,2.92 59.74,2.92 56.12,6.54 54.33,6.54 54.3,6.51 D5.1
BOOT0  (via drill 0.38)
  Top 0.254: v85.42,20.62 85.42,22.15 85.7,22.43 v86.84,22.43
  Top 0.305: v86.84,22.43 86.87,22.45 99.77,22.45 100.15,22.07 101.14,22.07 101.27,22.2 120.7,22.2 122.48,23.98 122.48,27.33 v123.98,28.83
  Bottom 0.254: 77.93,26.77 UC1.P$60 80.42,26.77 81,26.19 81,25.76 81.2,25.55 82.09,25.55 82.4,25.25 84.38,25.25 85.42,24.21 85.42,22.96 85.95,22.43 | UC1.P$40 85.42,20.32 v85.42,20.62
  Bottom 0.305: BOOT.A BOOT.A' 127,33.48 126.44,32.92 125.35,32.92 124.31,31.88 R16.1 124.31,29.16 v123.98,28.83 | 85.95,22.43 v86.84,22.43
D0  (via drill 0.38)
  Top 0.305: v100.84,22.81 120.12,22.81 121.64,24.33 v121.64,24.36
  Bottom 0.305: C32.1 FB1.1 99.39,24.26 v100.84,22.81 | v121.64,24.36 122.09,24.81 U2.4
DIN  (via drill 0.38)
  Top 0.305: 119.76,17.02 119.86,17.02 v119.99,17.14
  Top 0.406: 119.76,17.02 J1.2
  Bottom 0.305: FB2.1 124.28,21.79 124.28,17.93 123.5,17.14 v119.99,17.14
DISC  (via drill 0.38)
  Top 0.305: v76.71,23.27 76.71,23.09 75.72,22.1 74.83,22.1 74.22,22.71 68.07,22.71 67.44,22.07 67.44,19.74 66.62,18.92 66.62,9.22 v67.51,8.33 67.44,8.41
  Bottom 0.254: v67.51,8.33 68.5,8.33 R28.2 | UC1.P$53 v76.71,23.27
  Bottom 0.305: v76.71,23.27
ENABLE  (via drill 0.38)
  Top 0.305: v109.25,4.7 109.3,4.75 v109.3,8.64
  Bottom 0.305: 107.16,4.82 R41.1 107.28,4.7 v109.25,4.7 | v109.3,8.64 109.28,8.62 U11.1
GND  (via drill 0.38)  (2 unrouted)
  Top 0.254: v104.22,29.97 104.24,30.12
  Top 0.305: v109.68,30.35 107.37,30.35 v107.29,30.28 107.24,30.23 104.34,30.23 104.24,30.12 | J38.P$5 82.47,1.96 | J38.P$8 83.24,4.37 83.19,4.42 | J38.P$7 83.54,4.37 | 82.6,1.35 82.51,1.35 J38.P$6 | 89.61,2.01 89.52,2.01 J38.P$4 | 89.61,1.35 89.52,1.35 J38.P$3 | 88.67,4.29 88.38,4.29 | 88.38,4.29 J38.P$2 | 88.38,4.29 88.29,4.29
  Top 0.406: v69.8,5.23 72.49,5.23 v72.57,5.16
  Top 1.27: 82.22,1.63 82.6,1.63 | 83.54,4.17 83.54,4.37 83.54,4.55 | 83.19,4.17 83.19,4.42 83.19,4.55 | 82.6,1.96 82.47,1.96 82.22,1.96 | 82.6,1.35 82.22,1.35 | 89.61,2.01 89.23,2.01 | 89.61,1.35 89.23,1.35 | J38.S1 89.61,1.68 | 88.29,4.29 88.29,4.55 | 88.67,4.29 88.67,4.55
  Bottom 0.254: UC1.P$12 86.92,32.08 86.92,29.29 | 86.92,29.29 86.89,29.26 | UC1.P$18 92.3,28.27 92.33,28.3 92.3,28.3 92.28,28.27 89.46,28.27 89.43,28.3 | 76.35,28.27 UC1.P$63 81.18,28.27 81.2,28.3 | 89.53,23.29 89.56,23.27 UC1.P$28 92.46,23.27 | UC1.P$31 89.31,21.77 92.23,21.77 92.38,22.02 | 81.92,17.83 82.07,17.68 | 83.36,11.4 83.52,11.56 C21.2 83.52,11.63 83.34,11.46 | 82.12,17.73 82.17,17.68 82.17,15.27 81.89,14.99 C25.2 81.86,14.02 81.86,15.11 82.12,15.37 82.12,17.73 | 82.12,17.73 81.92,17.93 81.92,18.01 UC1.P$47 81.92,20.98 82.09,21.16 82.09,21.44 82.37,21.72 | 86.92,29.29 86.92,28.65 86.89,28.63 | U1.COM1 107.45,19.66 107.39,19.61 | U1.COM3 104.45,22.43 104.37,22.35 | U1.COM2 104.38,21.78 104.37,21.77 | U1.COM4 104.41,23.08 104.27,22.94 | C9.1 104.72,29.29 | C10.1 107.34,30.1 v107.29,30.28 | C11.1 109.7,30.33 v109.68,30.35
  Bottom 0.305: 77.19,89.69 72.64,89.69 72.4,89.44 C15.1 C12.2 70.87,87.13 | 77.19,89.69 81.36,89.69 82.86,91.19 82.86,91.98 | 84.58,91.98 C5.1 | R19.1 82.86,91.98 | 84.69,92.13 C5.1 | C16.1 76.94,89.43 77.19,89.69 | 82.86,91.98 82.98,92.1 C5.1 | C5.1 84.71,91.36 85.83,90.25 85.83,85.34 85.24,84.76 U3.11 | R10.1 83.72,63.52 83.26,63.98 83.26,66.75 | 83.26,66.75 83.26,67.77 Q3.2 | C18.1 83.29,66.73 83.26,66.75 | 72.62,65.2 72.82,65.41 72.82,68.38 72.31,68.89 U5.1 70.87,68.89 71.22,68.53 72.11,68.53 72.8,67.84 72.8,65.43 72.62,65.25 72.31,65.25 72.14,65.43 70.28,65.43 70.13,65.58 70.13,65.91 69.7,66.34 U5.3 | R31.2 R30.2 R15.2 | Q5.2 72.42,6.6 72.42,5.71 73.2,4.93 78.92,4.93 79.55,5.56 | 79.55,5.56 R38.2 | C26.2 75.8,28.27 76.35,28.27 76.33,28.24 76.33,26.14 75.92,25.73 C22.2 | 83.34,11.46 83.34,11.48 83.54,11.68 83.46,11.76 83.13,11.43 82.14,11.43 | 79.55,5.56 79.53,5.56 78.99,5.03 72.75,5.03 v72.57,5.16 | J38.P$7 J38.P5
  Bottom 0.406: 81.81,1.85 82.96,1.85 | 84.63,6.22 84.63,5.08 84.53,4.98 83.39,4.98 | C19.- 101.94,85.94 101.68,86.21 101.68,87.68 101.85,87.86 101.85,88.39 101.75,88.49 100.69,88.49 R12.1
  Bottom 0.813: 41.1,67.74 41.1,67.8 B1.4
  Bottom 1.93: 41.1,67.74 39.8,67.74 | 39.8,67.74 39.8,69.55 41.58,69.55 41.58,66.22 39.8,66.22 39.8,67.74 | 49.02,67.84 47.73,67.84 | 47.73,67.84 47.73,69.65 49.51,69.65 49.51,66.32 47.73,66.32 47.73,67.84
  pour Bottom (isolate 0.305, rank 2): 0.51,0.51 0.51,129.54 129.54,129.54 129.54,0.51
GND2
  Bottom 0.406: U11.2 107.24,7.67 107.21,7.64 104.72,7.64 104.65,7.72 102.16,7.72 C28.- 101.83,10.82 L4.1
  pour Bottom (isolate 0.381): 104.11,18.54 110.41,18.54 110.41,3.58 104.09,3.58 104.09,18.52
JTAG-TCK
  Bottom 0.254: UC1.P$49 68.77,21.27
  Bottom 0.305: 68.77,21.27 68.28,21.77 64.67,21.77 64.11,22.33 64.11,24.05 65.38,25.32 JTAG.3
JTAG-TDI
  Bottom 0.254: UC1.P$50 69.27,21.77 68.02,23.01
  Bottom 0.305: 68.02,23.01 65.41,23.01 JTAG.5
JTAG-TDO
  Bottom 0.254: UC1.P$55 68.82,24.27
  Bottom 0.305: 68.82,24.27 66.24,26.85 64.11,26.85 JTAG.4
JTAG-TMS  (via drill 0.38)
  Top 0.305: 82.63,20.65 v82.68,20.7 | JTAG.6 64.11,24.31 67.54,24.31 67.92,23.93 77.65,23.93 78.97,22.61 81.36,22.61 82.68,21.29 v82.68,20.7 | 82.68,21.03 v82.68,20.7
  Bottom 0.254: UC1.P$46 82.42,20.44
  Bottom 0.305: 82.42,20.44 v82.68,20.7
JTAG-TRST  (via drill 0.38)
  Top 0.254: 59.99,30.4 64.72,30.4 65.38,29.74 JTAG.1
  Top 0.305: v81.79,24.77 81.79,26.44 83.19,27.84 v84.43,27.84 88.29,27.84 89.64,26.49 100.84,26.49 101.5,27.15 101.5,33.35 103.56,35.41 103.56,36.22 103.25,36.52 103.25,37.29 104.29,38.33 104.29,42.11 v103.99,42.42 | 59.99,30.4 59.33,29.74 59.33,21.21 60.05,20.5 JTAG.8
  Bottom 0.305: 73.81,24.77 UC1.P$56 v81.78,24.77 v81.79,24.77 | 73.81,24.77 69.36,24.77 66.02,28.12 JTAG.1 | 73.81,24.77 C22.1 R6.2 | RESET.B RESET.B' 118.42,50.91 116.81,49.3 116.81,45.16 114.07,42.42 v103.99,42.42 | UC1.P$7 84.42,27.85 v84.43,27.84
LED1
  Bottom 0.305: R32.1 104.47,34.21 D4.+
MICROPH  (via drill 0.38)
  Top 0.305: v88.37,33.07 87.12,34.31 v87.12,48.21
  Bottom 0.254: 89.86,66.7 R9.1 | UC1.P$15 88.42,33.02 v88.37,33.07
  Bottom 0.305: v87.12,48.21 87.22,48.31 99.29,48.31 102.01,51.03 102.01,63.6 98.86,66.75 89.93,66.75 R9.1
N$1  (via drill 0.38)
  Top 0.406: J1.3 113.49,17.02 110.72,19.79 105.61,19.79 105.13,19.3 v100.43,19.3
  Bottom 0.406: J2.2 96.29,16.97 97.74,16.97 100.08,19.3 v100.43,19.3
N$2
  Top 0.406: J2.3 91.06,16.99 89.84,15.77 80.39,15.77 79.22,16.94 76.3,16.94 J3.2
N$3  (via drill 0.38)  (1 unrouted)
  Top 0.305: 56.31,16.97 64.72,16.97 v64.75,16.99
  Bottom 0.305: v64.75,16.99 73.71,16.99 J3.3
N$4  (via drill 0.38)
  Top 0.305: J5.2 v42.8,16.99
  Bottom 0.305: v42.8,16.99 J4.3
N$5
  Top 0.406: J5.3 J6.2
N$6  (via drill 0.38)
  Top 0.406: J7.3 v108.94,36.98
  Bottom 0.406: v108.94,36.98 107.26,38.66 99.67,38.66 97.97,36.96 96.29,36.96 J8.2
N$7  (via drill 0.38)
  Top 0.406: J8.3 92.1,36.98 91.01,38.08 v88.77,38.08 | v85.65,38.08 79.88,38.08 78.82,37.01 J9.2
  Bottom 0.406: v88.77,38.08 v85.65,38.08
N$8
  Top 0.406: J9.3 56.31,37.01 J10.2
N$9  (via drill 0.38)
  Top 0.305: J11.2 42.98,36.98 v43,36.96
  Bottom 0.305: v43,36.96 53.72,36.96 J10.3
N$10  (via drill 0.38)
  Top 0.406: v22.96,35.2 22.4,35.2 20.57,37.03 16.33,37.03 J12.2
  Bottom 0.406: J11.3 30.99,36.98 29.21,35.2 v22.96,35.2 | 16.36,37.06 J12.2
N$11
  Top 0.406: J13.3 J14.2
N$12  (via drill 0.38)
  Top 0.406: J14.3 88.7,56.97 v88.65,57.02
  Bottom 0.406: v88.65,57.02 87.68,56.06 79.83,56.06 78.92,56.97 J15.2
N$13
  Top 0.406: J15.3 J16.2
N$14
  Top 0.406: J16.3 36.3,56.97 J17.2
N$15
  Top 0.406: J17.3 16.33,57 J18.2
N$16
  Top 0.406: J19.3 J20.2
N$17
  Top 0.406: J20.3 J21.2
N$18
  Top 0.406: J21.3 J22.2
N$19
  Top 0.406: J22.3 J23.2
N$20
  Top 0.406: J23.3 16.31,76.99 J24.2
N$21
  Top 0.406: J25.3 J26.2
N$22
  Top 0.406: J26.3 J27.2
N$23
  Top 0.406: J27.3 J28.2
N$24
  Top 0.406: J28.3 J29.2
N$25
  Top 0.406: J29.3 J30.2
N$26
  Top 0.406: J31.3 96.29,117.02 J32.2
N$27
  Top 0.406: J32.3 J33.2
N$28
  Top 0.406: J33.3 J34.2
N$29
  Top 0.406: J34.3 36.3,116.99 J35.2
N$30
  Top 0.406: J35.3 J36.2
N$31  (via drill 0.38)
  Top 0.305: v94.92,51.54 95.4,51.05 117.53,51.05 v119.71,48.87 | v80.49,50.55 80.44,50.55 78.84,52.15 9.35,52.15 8.38,51.18 v8.38,25.88
  Bottom 0.305: J6.3 10.92,16.99 9.98,17.93 9.53,18.39 8.38,19.53 v8.38,25.88 | v94.92,51.54 81.48,51.54 v80.49,50.55 | v119.71,48.87 119.71,38.08 118.62,36.98 J7.2
  Bottom 0.406: v80.49,50.55 80.54,50.55
N$32
  Bottom 0.305: Q3.1 86.03,66.85 C18.2 85.94,66.76 R9.2
N$33  (via drill 0.38)
  Top 0.305: J12.3 11.48,36.98 10.41,38.05 10.41,48.64 12.24,50.47 v77.9,50.47 | v98.7,52.86 118.87,52.86 119.99,53.98 119.99,56.08 119.08,57 116.31,57 J13.2
  Bottom 0.305: v98.7,52.86 98.68,52.83 80.26,52.83 v77.9,50.47
N$34  (via drill 0.38)
  Top 0.305: J18.3 11.15,56.95 9.8,58.29 v9.8,58.85 | v100.41,71.96 120.09,71.96 121.28,73.15 121.28,75.77 120.07,76.99 J19.2 | v79.25,71.83 11.58,71.83 v9.8,70.05
  Bottom 0.305: v9.8,58.85 9.8,69.01 v9.8,70.05 | v79.25,71.83 80.62,73.2 89.28,73.2 90.53,71.96 v100.41,71.96
N$35  (via drill 0.38)
  Top 0.305: J24.3 10.82,76.96 9.78,78 9.78,78.77 v9.75,78.79 | J25.2 119.41,96.98 120.55,95.83 120.55,93.55 119.15,92.15 63.78,92.15 61.57,89.94 10.69,89.94 v9.78,89.03
  Bottom 0.305: v9.78,89.03 9.78,78.82 v9.75,78.79
N$36  (via drill 0.38)
  Top 0.406: J31.2 119.46,117.02 121.08,115.39 121.08,113.18 120.24,112.34 11.43,112.34 v9.65,110.57 | J30.3 13.66,96.93 11.35,96.93 10.02,98.26 v9.65,98.63
  Bottom 0.406: v9.65,110.57 v9.65,98.63
N$37
  Bottom 0.254: 80.52,41.76 X1.2 80.52,41.81 | UC1.P$5 83.42,32.31 82.27,33.45
  Bottom 0.305: 82.27,33.45 82.27,40.06 X1.2 80.54,45.47 C2.2
N$38
  Bottom 0.254: 89.99,41.58 X1.1 | UC1.P$6 83.92,32.64 82.83,33.73
  Bottom 0.305: 82.83,33.73 82.83,38.81 85.8,41.78 X1.1 | 90.22,41.76 X1.1 | C20.2 X1.1
N$39
  Bottom 0.254: UC1.P$11 86.42,32.62 | 87.2,33.4 87.43,33.4 R15.1
  Bottom 0.305: R15.1 R14.2 | 86.42,32.62 87.2,33.4
N$40
  Bottom 0.305: R27.1 86.39,11.56 86.58,11.36 86.58,4.52 J38.P2
N$41
  Bottom 0.406: U11.3 109.6,6.73 110.16,7.29 110.16,9.22 109.47,9.91 108.66,9.91 108.25,10.31
  Bottom 0.61: 108,10.06 108.25,10.31 108.36,10.41 L1.1 | L1.1
N$42
  Bottom 0.305: D1.- 56.16,68.89 R34.2
N$43  (via drill 0.38)
  Top 0.305: v89.03,26.09 89.18,25.93 101.12,25.93 102.11,26.92 102.11,33.05 104.27,35.2 104.27,36.65 v104.01,36.91
  Bottom 0.305: 102.84,35.71 R32.2 102.87,36.37 103.38,36.88 103.99,36.88 v104.01,36.91 | UC1.P$21 89.71,26.77 v89.03,26.09
N$44
  Bottom 0.254: 94.93,24.27 FB1.2
  Bottom 0.305: UC1.P$26 94.93,24.27 FB1.2
N$45
  Bottom 0.254: UC1.P$8 84.92,33.04 84.1,33.86
  Bottom 0.305: 84.1,33.86 84.1,34.37 R29.2
N$46
  Bottom 0.305: R35.2 56.16,65.86 D2.-
N$47
  Bottom 0.305: U5.7 62.56,67.51 58.32,67.51 58.24,67.44 R34.1
N$48
  Bottom 0.305: R35.1 57.81,65.99 59.41,65.99 59.77,66.34 U5.6
N$49
  Bottom 0.305: U5.2 70.08,67.61 R36.2
N$50
  Bottom 0.254: UC1.P$10 85.92,33.08
  Bottom 0.305: 85.92,33.08 87,34.16 R30.1
N$51
  Bottom 0.254: 78.28,8.59 78.28,8.23 77.67,7.62 76.86,7.62 Q6.2
  Bottom 0.305: R37.1 80.34,10.64 78.28,8.59
N$52
  Bottom 0.305: R41.2 105.72,4.72 105.18,5.26 U11.4
  Bottom 0.406: L2.1 101.65,5.33 C28.+
  Bottom 0.61: U11.4 104.1,6.72 102.89,5.51 C28.+
N$53
  Bottom 0.254: UC1.P$9 85.42,34.26
  Bottom 0.305: 85.42,34.26 R31.1
N$54
  cutout Bottom (isolate 0.305): 105.61,24.89 109.91,24.89 109.91,20.65 105.61,20.65
N$55
  Bottom 0.305: R7.1 84.96,12.12 85.93,11.15 85.93,4.51 J38.P3
N$56
  Bottom 0.61: U11.5 105.18,11.71 L1.2 105.16,13.26 105.39,13.49 C33.1 105.37,14.69 105.37,15.98 | C27.+ 105.37,15.98 | L3.2 105.19,16.15 105.37,15.98
N$57
  Bottom 0.305: U2.3 125.96,24.6 FB2.2
N$58
  Bottom 1.27: D6.2 42.4,4.54 39.67,7.26 D3.- 35.92,9.5 34.72,8.31 SW3.CH2A SW3.CH1A
N$59
  Bottom 1.27: D5.2 46.42,4.17 D6.1
N$65  (via drill 0.38)
  Top 0.305: v26.34,21.77 26.34,44.48 27.74,45.87 v30.18,45.87
  Bottom 0.305: Q4.1 R4.1 v26.34,21.77 | Q2.2 28.88,48.41 30.15,47.14 30.15,45.9 v30.18,45.87
  Bottom 2.184: Q2.2 42.16,48.41 R3.2
N$66  (via drill 0.38)
  Top 0.305: v87.05,65.05 87.05,70.79 v87.02,70.81
  Bottom 0.305: R8.1 v87.05,65.05 | v87.02,70.81 85.17,70.81 Q3.3
N$67  (via drill 0.38)
  Top 0.305: v19.89,47.47 22.91,47.47 25.5,44.88 25.5,27.96 v24.33,26.8
  Bottom 0.305: R5.1 R4.2 25.83,24.87 Q4.3 23.85,24.97 23.85,26.31 v24.33,26.8 | Q2.1 20.83,48.41 v19.89,47.47
N$68
  Bottom 0.305: C14.2 85.98,58.9 R17.1
N$69  (via drill 0.38)
  Top 0.305: v84.45,57.61 85.57,58.73 85.57,62.69 86.39,63.5 86.39,74.93 v85.57,75.74
  Bottom 0.305: C15.2 R26.1 73.81,87.1 73.81,85.17 73.43,84.78 73.43,82.19 74.04,81.58 77.7,81.58 80.16,79.12 | 79.05,80.21 80.14,79.12 80.16,79.12 | v85.57,75.74 85.57,77.24 83.69,79.12 80.8,79.12 80.16,79.12 | v84.45,57.61 84.45,58.85 R17.2
N$70
  Bottom 0.305: R26.2 R24.1 75.39,88.67 C16.2 R23.1 83.74,87.12 U3.13
N$71
  Bottom 0.254: R38.1 81.08,6.83 R39.2 79.43,8.31
  Bottom 0.305: Q5.3 71.65,8.69 71.2,8.23 71.2,5.05 71.98,4.27 79.27,4.27 81.08,6.07 R38.1 | Q6.1 79.32,8.31 R39.2
N$72
  Bottom 0.305: C6.1 R13.1 116.73,89.06 117.55,88.24 120.49,88.24 M1.IN
N$73
  Bottom 0.305: Q5.1 74.14,7.26 74.52,7.64 74.52,9.73 73.97,10.29 71.48,10.29 70.13,8.94 R28.1 70.08,8.18 R40.2
N$75
  Bottom 0.305: 106.78,21.03 106.78,19.96
N$76
  Bottom 0.305: 108.1,21.03 108.1,20.07
N$77
  Bottom 0.305: 108.74,21.01 108.74,20.09
N$78
  Bottom 0.305: 106.81,24.51 106.81,25.43
N$79
  Bottom 0.305: 108.1,24.51 108.1,25.5
N$80
  Bottom 0.305: 109.53,21.77 110.21,21.77
N$81
  Bottom 0.305: 109.53,23.75 110.21,23.75
N$96
  Bottom 0.305: R19.2 85.86,93.8 R18.1 85.9,93.82 85.9,93.07 86.23,92.73 C5.2 86.53,92.11 87.17,91.47 87.17,86.41 87.58,86 89.89,86 U3.3
N$97  (via drill 0.38)
  Top 0.305: v102.64,87.83 98.15,87.83 97.87,87.55 97.87,84.33 96.88,83.34 86.87,83.34 v85.78,82.25
  Bottom 0.305: C6.2 102.94,87.54 v102.64,87.83 | v85.78,82.25 83.94,82.25 U3.9 83.88,82.25 81.46,82.25 80.06,83.64 80.06,84.45 79.6,84.91 R20.1
N$98
  Bottom 0.305: U3.8 80.91,80.94 78.46,83.39 R20.2 78.35,83.42 C13.1
N$99
  Bottom 0.305: C13.2 75.37,83.42 R21.1
N$100
  Bottom 0.254: 93.5,83.51 93.58,83.6 R22.1
  Bottom 0.305: R21.2 74.93,84.68 74.45,84.68 74.12,84.35 74.12,82.63 74.47,82.27 78.28,82.27 80.7,79.86 85.24,79.86 87.61,82.22 U3.6 89.91,82.22 92.2,82.22 93.5,83.51
N$101
  Bottom 0.305: C14.1 C17.2 84.45,62.05 R10.2 R8.2
N$102
  Bottom 0.254: 70.88,89.37 70.89,89.38 70.89,89.97 71.81,90.88 81.23,90.88 81.69,91.34 81.81,91.52
  Bottom 0.305: C12.1 70.88,89.37 | R18.2 | 99.16,83.77 R11.2 | 103.24,83.03 C19.+ 103.35,82.92 | 109.78,87.51 R13.2
  Bottom 0.406: 81.81,91.52 81.81,94.44 82.45,95.07 86.94,95.07 87.43,94.59 R18.2 | U3.4 93.19,84.75 | 93.19,84.75 97.39,84.75 98.37,83.77 99.16,83.77 | R11.2 100.55,83.83 101.35,83.03 103.24,83.03 | R25.1 103.35,82.92 109.06,82.92 109.78,83.64 109.78,87.51 | R18.2 87.42,92.34 88.01,91.75 88.01,90.35 88.42,89.94 91.82,89.94 92.91,88.85 92.91,85.03 93.19,84.75
N$104  (via drill 0.38)
  Top 0.305: v83.87,89.97 95.73,89.97 v97.33,88.37
  Bottom 0.305: R23.2 83.82,88.65 U3.14 83.91,89.93 v83.87,89.97 | v97.33,88.37 99.17,88.37 C7.1
N$106  (via drill 0.38)
  Top 0.305: v87.96,64.44 v87.96,75.92
  Bottom 0.254: R22.2 95.76,82.98 95.4,82.63 93.5,82.63 91.9,81.03 91.9,80.97
  Bottom 0.305: v87.96,75.92 87.53,76.35 87.53,80.11 88.36,80.94 U3.7 89.94,80.97 91.9,80.97 | C17.1 86.28,61.98 87.96,63.65 v87.96,64.44
REF  (via drill 0.38)
  Top 0.305: v88.16,87.27 87.81,87.27 86.89,86.36 v86.89,84.73
  Bottom 0.305: R24.2 75.32,86.73 76.1,85.95 81.25,85.95 | 81.25,85.95 83.84,85.95 U3.12 | 81.25,85.95 81.38,85.83 81.38,84.1 82,83.48 U3.10 86.87,83.48 | U3.1 U3.2 88.18,87.29 v88.16,87.27 | 86.87,83.48 U3.5 | v86.89,84.73 86.89,83.51 86.87,83.48
RX  (via drill 0.38)
  Top 0.305: v83.9,24.51 83.92,24.51 84.73,25.32 101.37,25.32 102.72,26.67 102.72,32.74 104.9,34.92 104.9,43.26 103.99,44.17 J37.3
  Bottom 0.254: UC1.P$43 83.92,24.49
  Bottom 0.305: 83.92,24.49 v83.9,24.51
SOUND  (via drill 0.38)
  Top 0.305: v89.28,32.82 89.28,33.53 87.73,35.08 87.73,47.27 v88.04,47.57 | v100.38,85.24 100.38,82.93 v101.93,81.38
  Bottom 0.254: R11.1 100.27,85.35 v100.38,85.24
  Bottom 0.305: R12.2 100.62,86.9 C7.2 99.23,85.36 R11.1 | UC1.P$16 88.92,32.45 v89.28,32.82 | v101.93,81.38 102.08,81.23 102.08,78.05 102.69,77.44 102.69,50.75 99.52,47.57 v88.04,47.57
SW+5V  (via drill 0.38, 0.6)
  Top 0.305: v65.43,5.54 65.43,4.32 65.35,4.24 | v82.19,9.37 82.14,9.32 82.14,8.33 | v31.57,8.43 24.08,8.43 22.86,9.65 v22.86,14.99
  Top 0.406: v98.04,5.97 98.04,3.91 99.16,2.79 113,2.79 127.56,17.35 v127.56,17.37
  Top 0.61: v98.04,5.97 93.27,5.97 90.91,8.33 82.14,8.33 81.76,8.33 77.67,4.24 65.35,4.24 51.08,4.24 48.11,7.21 48.11,8.74 46.99,7.62 46.76,7.62 46.74,7.64
  Top 1.016: 34.19,7.64 46.74,7.64 47.93,8.84 47.93,39.85 53.37,45.29 R3.1
  Top 1.27: SW3.COM1 32.72,6.17 34.19,7.64
  Bottom 0.305: Q4.2 v22.86,14.99 | v31.57,8.43 32.69,7.32 32.69,4.65 SW3.COM2 | R44.1 v65.43,5.54 | R39.1 v82.19,9.37 | 127.02,26.71 U2.1
  Bottom 0.406: v127.56,17.37 127.56,26.16 127.02,26.71
  Bottom 0.61: L2.2 98.93,6.86 v98.04,5.97
  Bottom 0.813: 32.69,7.32 32.69,2.15 SW3.COM1
TX  (via drill 0.38)
  Top 0.305: v84.61,24.03 84.61,24.31 85.04,24.74 101.7,24.74 103.35,26.39 103.35,32.44 105.51,34.59 105.51,44.5 106.53,45.52 J37.2
  Bottom 0.254: UC1.P$42 84.42,23.84 v84.61,24.03
USB_P  (via drill 0.38)
  Top 0.305: 63.91,9.86 v63.91,9.63 65.99,11.71 65.99,19.15 66.8,19.96 66.8,22.45 67.64,23.29 74.88,23.29 v75.31,22.86
  Bottom 0.254: UC1.P$52 77.33,22.77 77.04,22.48
  Bottom 0.305: R44.2 R45.1 63.91,9.6 63.88,9.63 v63.91,9.63 | v75.31,22.86 75.31,22.81 75.64,22.48 77.04,22.48
USBM
  Bottom 0.254: UC1.P$44 83.42,16.59 | 83.41,16.59 83.41,15.72
  Bottom 0.305: 83.42,16.59 83.41,16.59 | 83.41,15.72 84.18,14.96 85.88,14.96 86.39,14.45 R27.2 C31.1
USBP
  Bottom 0.254: UC1.P$45 82.92,15.26
  Bottom 0.305: 82.92,15.26 83.46,14.71 83.46,13.95 C21.1 | C21.1 R7.2 | C21.1 83.34,13.89 R37.2
V+  (via drill 0.38, 0.6)
  Top 0.254: v88.57,39.45 88.57,39.73 88.54,39.75
  Top 0.305: v22.94,67.69 22.84,67.69
  Top 0.406: v89.36,14.99 90.65,13.95 90.98,13.95 | v75.74,45.62 75.51,45.62 | v115.65,46.15 115.62,46.13 115.34,46.13 | v111.12,65.79 111.1,65.81 110.85,65.81 | v45.97,104.29 45.87,104.29 | v16.64,27.36 16.79,27.33 16.51,27.33 | v44.73,86.06 44.7,86.03 44.7,85.65 | J3.1 76.25,19.51 74.98,18.24 71.91,18.24 | J2.1 98.2,17.6 | J1.1 116.28,19.53 117.75,18.06 118.64,18.06 118.67,18.03
  Top 2.184: v31.34,43.36 v35.08,43.36 | v39.29,43.36 v42.88,43.36
  Bottom 0.254: R14.1 89.86,38.91 89.33,39.45 v88.57,39.45
  Bottom 0.305: C1.+ 22.95,67.7 v22.94,67.69 | C3.2 v26.97,66.78 v26.98,66.78
  Bottom 0.406: C39.1 89.38,13.92 v89.36,14.99 | C38.1 v75.74,45.62 | C37.1 v115.65,46.15 | C36.1 110.01,65.79 v111.12,65.79 | C35.1 44.83,104.29 v45.97,104.29 | C4.1 v16.64,27.36 | C34.1 44.73,84.81 v44.73,86.06
  Bottom 2.184: Q2.3 25.46,41.11 27.71,43.36 31.27,43.36 | v31.34,43.36 31.29,43.31 31.22,43.31 31.27,43.36 | v35.08,43.36 v39.29,43.36 | v42.88,43.36 31.27,43.36
  pour Top (isolate 0.305, rank 2): 0.51,0.51 0.51,129.54 129.54,129.54 129.54,0.51
VBAT  (via drill 0.6)
  Top 0.813: v50.34,47.88 50.34,44.6 46.41,40.66 46.41,15.7 v44.12,13.41
  Bottom 0.813: U5.5 61.75,65.08 58.98,62.31 52.22,62.31 50.29,64.24 45.03,64.24 43.79,62.99 43.79,60.65 B1.+ C30.+ 43.81,53.59 45.16,52.25 49.25,52.25 50.34,51.16 v50.34,47.88 | v44.12,13.41 44.12,9.53 D3.+
XOUT
  Bottom 0.254: UC1.P$20 92.88,27.27 93.5,27.89 100.13,27.89 101.32,29.08
  Bottom 0.305: 101.32,29.08 102.51,29.08 102.82,29.39 102.82,30.68 103.43,31.29 108.15,31.29 108.53,30.91 108.53,28.07 108.84,27.76 C11.2 109.7,26.95 108.75,25.99 U1.X
YOUT
  Bottom 0.254: UC1.P$22 92.69,26.27 93.8,27.38 100.69,27.38 101.7,28.4
  Bottom 0.305: 101.7,28.4 102.74,28.4 103.48,29.13 103.48,30.35 103.83,30.71 106.07,30.71 106.35,30.43 106.35,27.99 106.55,27.79 C10.2 107.45,27.68 U1.Y
ZOUT
  Bottom 0.254: UC1.P$23 92.98,25.77 94.06,26.85 100.97,26.85 101.09,26.85 102.01,27.76
  Bottom 0.305: 102.01,27.76 C9.2 104.8,27.23 104.8,24.05 105.12,23.73 U1.Z

### Text on the board
dxf: 6x6x6 Cube Baseboard foam die cut
200bmp: C:/Users/engineer/Desktop/word.bmp